# EAGLE schematic main (EAGLE 8.0.0), part 4 of 4
## Sheet 41 of 48: rega mux
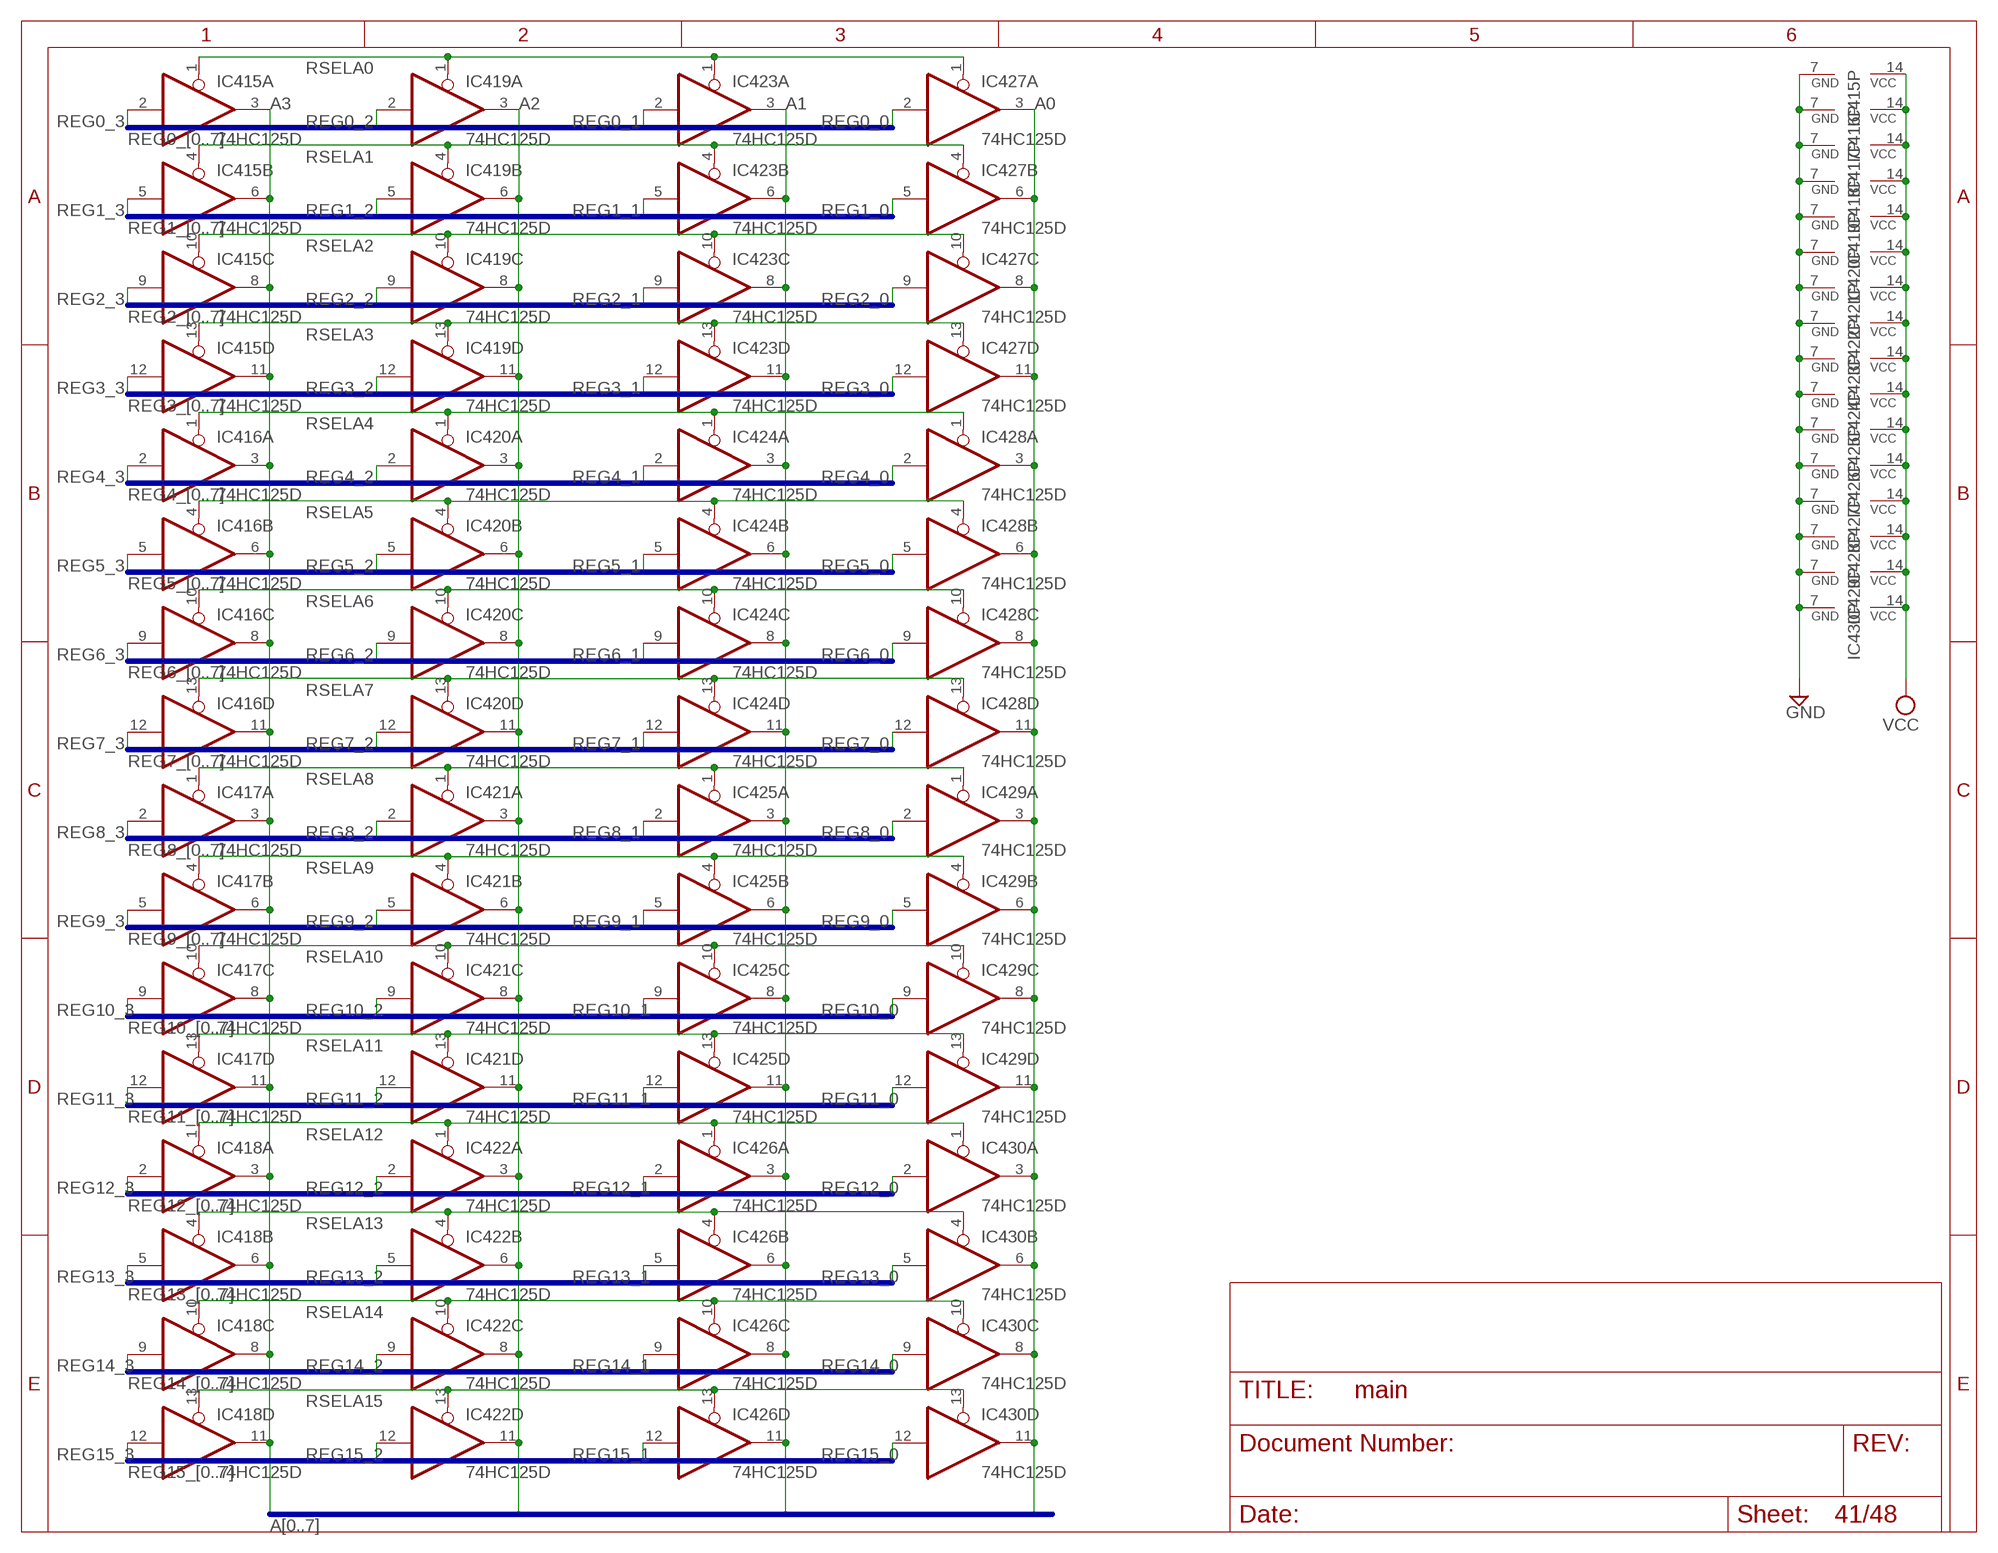
[diagram p39: schematic, sheet 41]

### Parts
IC415  74HC125D  [SO14]
IC416  74HC125D  [SO14]
IC417  74HC125D  [SO14]
IC418  74HC125D  [SO14]
IC419  74HC125D  [SO14]
IC420  74HC125D  [SO14]
IC421  74HC125D  [SO14]
IC422  74HC125D  [SO14]
IC423  74HC125D  [SO14]
IC424  74HC125D  [SO14]
IC425  74HC125D  [SO14]
IC426  74HC125D  [SO14]
IC427  74HC125D  [SO14]
IC428  74HC125D  [SO14]
IC429  74HC125D  [SO14]
IC430  74HC125D  [SO14]

### Nets
A0: IC427.3(A:O) IC427.6(B:O) IC427.8(C:O) IC427.11(D:O) IC428.3(A:O) IC428.6(B:O) IC428.8(C:O) IC428.11(D:O) IC429.3(A:O) IC429.6(B:O) IC429.8(C:O) IC429.11(D:O) IC430.3(A:O) IC430.6(B:O) IC430.8(C:O) IC430.11(D:O) ; also sheet 1,3,4,11,24,25,26,30,34
A1: IC423.3(A:O) IC423.6(B:O) IC423.8(C:O) IC423.11(D:O) IC424.3(A:O) IC424.6(B:O) IC424.8(C:O) IC424.11(D:O) IC425.3(A:O) IC425.6(B:O) IC425.8(C:O) IC425.11(D:O) IC426.3(A:O) IC426.6(B:O) IC426.8(C:O) IC426.11(D:O) ; also sheet 1,3,4,11,19,24,25,26,30,34
A2: IC419.3(A:O) IC419.6(B:O) IC419.8(C:O) IC419.11(D:O) IC420.3(A:O) IC420.6(B:O) IC420.8(C:O) IC420.11(D:O) IC421.3(A:O) IC421.6(B:O) IC421.8(C:O) IC421.11(D:O) IC422.3(A:O) IC422.6(B:O) IC422.8(C:O) IC422.11(D:O) ; also sheet 1,24,25,26,30,34
A3: IC415.3(A:O) IC415.6(B:O) IC415.8(C:O) IC415.11(D:O) IC416.3(A:O) IC416.6(B:O) IC416.8(C:O) IC416.11(D:O) IC417.3(A:O) IC417.6(B:O) IC417.8(C:O) IC417.11(D:O) IC418.3(A:O) IC418.6(B:O) IC418.8(C:O) IC418.11(D:O) ; also sheet 1,2,5,6,11,22,24,25,26,30,34
GND: IC415.7(P:GND) IC416.7(P:GND) IC417.7(P:GND) IC418.7(P:GND) IC419.7(P:GND) IC420.7(P:GND) IC421.7(P:GND) IC422.7(P:GND) IC423.7(P:GND) IC424.7(P:GND) IC425.7(P:GND) IC426.7(P:GND) IC427.7(P:GND) IC428.7(P:GND) IC429.7(P:GND) IC430.7(P:GND) ; also sheet 1,2,3,4,5,6,7,8,9,10,11,12,13,14,15,16,17,18,19,20,21,22,23,24,25,26,27,28,29,30,31,32,33,34,37,38,39,40,42,43,44,45,46,47
REG0_0: IC427.2(A:I) ; also sheet 43
REG0_1: IC423.2(A:I) ; also sheet 43
REG0_2: IC419.2(A:I) ; also sheet 43
REG0_3: IC415.2(A:I) ; also sheet 43
REG1_0: IC427.5(B:I) ; also sheet 43
REG1_1: IC423.5(B:I) ; also sheet 43
REG1_2: IC419.5(B:I) ; also sheet 43
REG1_3: IC415.5(B:I) ; also sheet 43
REG2_0: IC427.9(C:I) ; also sheet 43
REG2_1: IC423.9(C:I) ; also sheet 43
REG2_2: IC419.9(C:I) ; also sheet 43
REG2_3: IC415.9(C:I) ; also sheet 43
REG3_0: IC427.12(D:I) ; also sheet 43
REG3_1: IC423.12(D:I) ; also sheet 43
REG3_2: IC419.12(D:I) ; also sheet 43
REG3_3: IC415.12(D:I) ; also sheet 43
REG4_0: IC428.2(A:I) ; also sheet 43
REG4_1: IC424.2(A:I) ; also sheet 43
REG4_2: IC420.2(A:I) ; also sheet 43
REG4_3: IC416.2(A:I) ; also sheet 43
REG5_0: IC428.5(B:I) ; also sheet 43
REG5_1: IC424.5(B:I) ; also sheet 43
REG5_2: IC420.5(B:I) ; also sheet 43
REG5_3: IC416.5(B:I) ; also sheet 43
REG6_0: IC428.9(C:I) ; also sheet 43
REG6_1: IC424.9(C:I) ; also sheet 43
REG6_2: IC420.9(C:I) ; also sheet 43
REG6_3: IC416.9(C:I) ; also sheet 43
REG7_0: IC428.12(D:I) ; also sheet 43
REG7_1: IC424.12(D:I) ; also sheet 43
REG7_2: IC420.12(D:I) ; also sheet 43
REG7_3: IC416.12(D:I) ; also sheet 43
REG8_0: IC429.2(A:I) ; also sheet 43
REG8_1: IC425.2(A:I) ; also sheet 43
REG8_2: IC421.2(A:I) ; also sheet 43
REG8_3: IC417.2(A:I) ; also sheet 43
REG9_0: IC429.5(B:I) ; also sheet 43
REG9_1: IC425.5(B:I) ; also sheet 43
REG9_2: IC421.5(B:I) ; also sheet 43
REG9_3: IC417.5(B:I) ; also sheet 43
REG10_0: IC429.9(C:I) ; also sheet 43
REG10_1: IC425.9(C:I) ; also sheet 43
REG10_2: IC421.9(C:I) ; also sheet 43
REG10_3: IC417.9(C:I) ; also sheet 43
REG11_0: IC429.12(D:I) ; also sheet 43
REG11_1: IC425.12(D:I) ; also sheet 43
REG11_2: IC421.12(D:I) ; also sheet 43
REG11_3: IC417.12(D:I) ; also sheet 43
REG12_0: IC430.2(A:I) ; also sheet 43
REG12_1: IC426.2(A:I) ; also sheet 43
REG12_2: IC422.2(A:I) ; also sheet 43
REG12_3: IC418.2(A:I) ; also sheet 43
REG13_0: IC430.5(B:I) ; also sheet 43
REG13_1: IC426.5(B:I) ; also sheet 43
REG13_2: IC422.5(B:I) ; also sheet 43
REG13_3: IC418.5(B:I) ; also sheet 43
REG14_0: IC430.9(C:I) ; also sheet 43,47
REG14_1: IC426.9(C:I) ; also sheet 43,47
REG14_2: IC422.9(C:I) ; also sheet 43,47
REG14_3: IC418.9(C:I) ; also sheet 43,47
REG15_0: IC430.12(D:I) ; also sheet 43,48
REG15_1: IC426.12(D:I) ; also sheet 43
REG15_2: IC422.12(D:I) ; also sheet 43
REG15_3: IC418.12(D:I) ; also sheet 43
RSELA0: IC415.1(A:OE) IC419.1(A:OE) IC423.1(A:OE) IC427.1(A:OE) ; also sheet 38,40
RSELA1: IC415.4(B:OE) IC419.4(B:OE) IC423.4(B:OE) IC427.4(B:OE) ; also sheet 38,40
RSELA2: IC415.10(C:OE) IC419.10(C:OE) IC423.10(C:OE) IC427.10(C:OE) ; also sheet 38,40
RSELA3: IC415.13(D:OE) IC419.13(D:OE) IC423.13(D:OE) IC427.13(D:OE) ; also sheet 38,40
RSELA4: IC416.1(A:OE) IC420.1(A:OE) IC424.1(A:OE) IC428.1(A:OE) ; also sheet 38,40,42
RSELA5: IC416.4(B:OE) IC420.4(B:OE) IC424.4(B:OE) IC428.4(B:OE) ; also sheet 38,40
RSELA6: IC416.10(C:OE) IC420.10(C:OE) IC424.10(C:OE) IC428.10(C:OE) ; also sheet 38,40
RSELA7: IC416.13(D:OE) IC420.13(D:OE) IC424.13(D:OE) IC428.13(D:OE) ; also sheet 38,40
RSELA8: IC417.1(A:OE) IC421.1(A:OE) IC425.1(A:OE) IC429.1(A:OE) ; also sheet 38,40
RSELA9: IC417.4(B:OE) IC421.4(B:OE) IC425.4(B:OE) IC429.4(B:OE) ; also sheet 38,40
RSELA10: IC417.10(C:OE) IC421.10(C:OE) IC425.10(C:OE) IC429.10(C:OE) ; also sheet 38,40
RSELA11: IC417.13(D:OE) IC421.13(D:OE) IC425.13(D:OE) IC429.13(D:OE) ; also sheet 38,40
RSELA12: IC418.1(A:OE) IC422.1(A:OE) IC426.1(A:OE) IC430.1(A:OE) ; also sheet 38,40
RSELA13: IC418.4(B:OE) IC422.4(B:OE) IC426.4(B:OE) IC430.4(B:OE) ; also sheet 38,40
RSELA14: IC418.10(C:OE) IC422.10(C:OE) IC426.10(C:OE) IC430.10(C:OE) ; also sheet 38,40
RSELA15: IC418.13(D:OE) IC422.13(D:OE) IC426.13(D:OE) IC430.13(D:OE) ; also sheet 38,40
VCC: IC415.14(P:VCC) IC416.14(P:VCC) IC417.14(P:VCC) IC418.14(P:VCC) IC419.14(P:VCC) IC420.14(P:VCC) IC421.14(P:VCC) IC422.14(P:VCC) IC423.14(P:VCC) IC424.14(P:VCC) IC425.14(P:VCC) IC426.14(P:VCC) IC427.14(P:VCC) IC428.14(P:VCC) IC429.14(P:VCC) IC430.14(P:VCC) ; also sheet 1,2,3,4,5,6,7,8,9,10,11,12,13,14,15,16,17,18,19,20,21,22,23,24,25,26,27,28,29,30,31,32,33,34,37,38,39,40,42,43,44,45,46,47

### Buses
A[0..7]
REG0_[0..7]
REG1_[0..7]
REG3_[0..7]
REG4_[0..7]
REG5_[0..7]
REG6_[0..7]
REG7_[0..7]
REG8_[0..7]
REG9_[0..7]
REG10_[0..7]
REG11_[0..7]
REG12_[0..7]
REG13_[0..7]
REG14_[0..7]
REG15_[0..7]
REG2_[0..7]

## Sheet 42 of 48: rselb mux
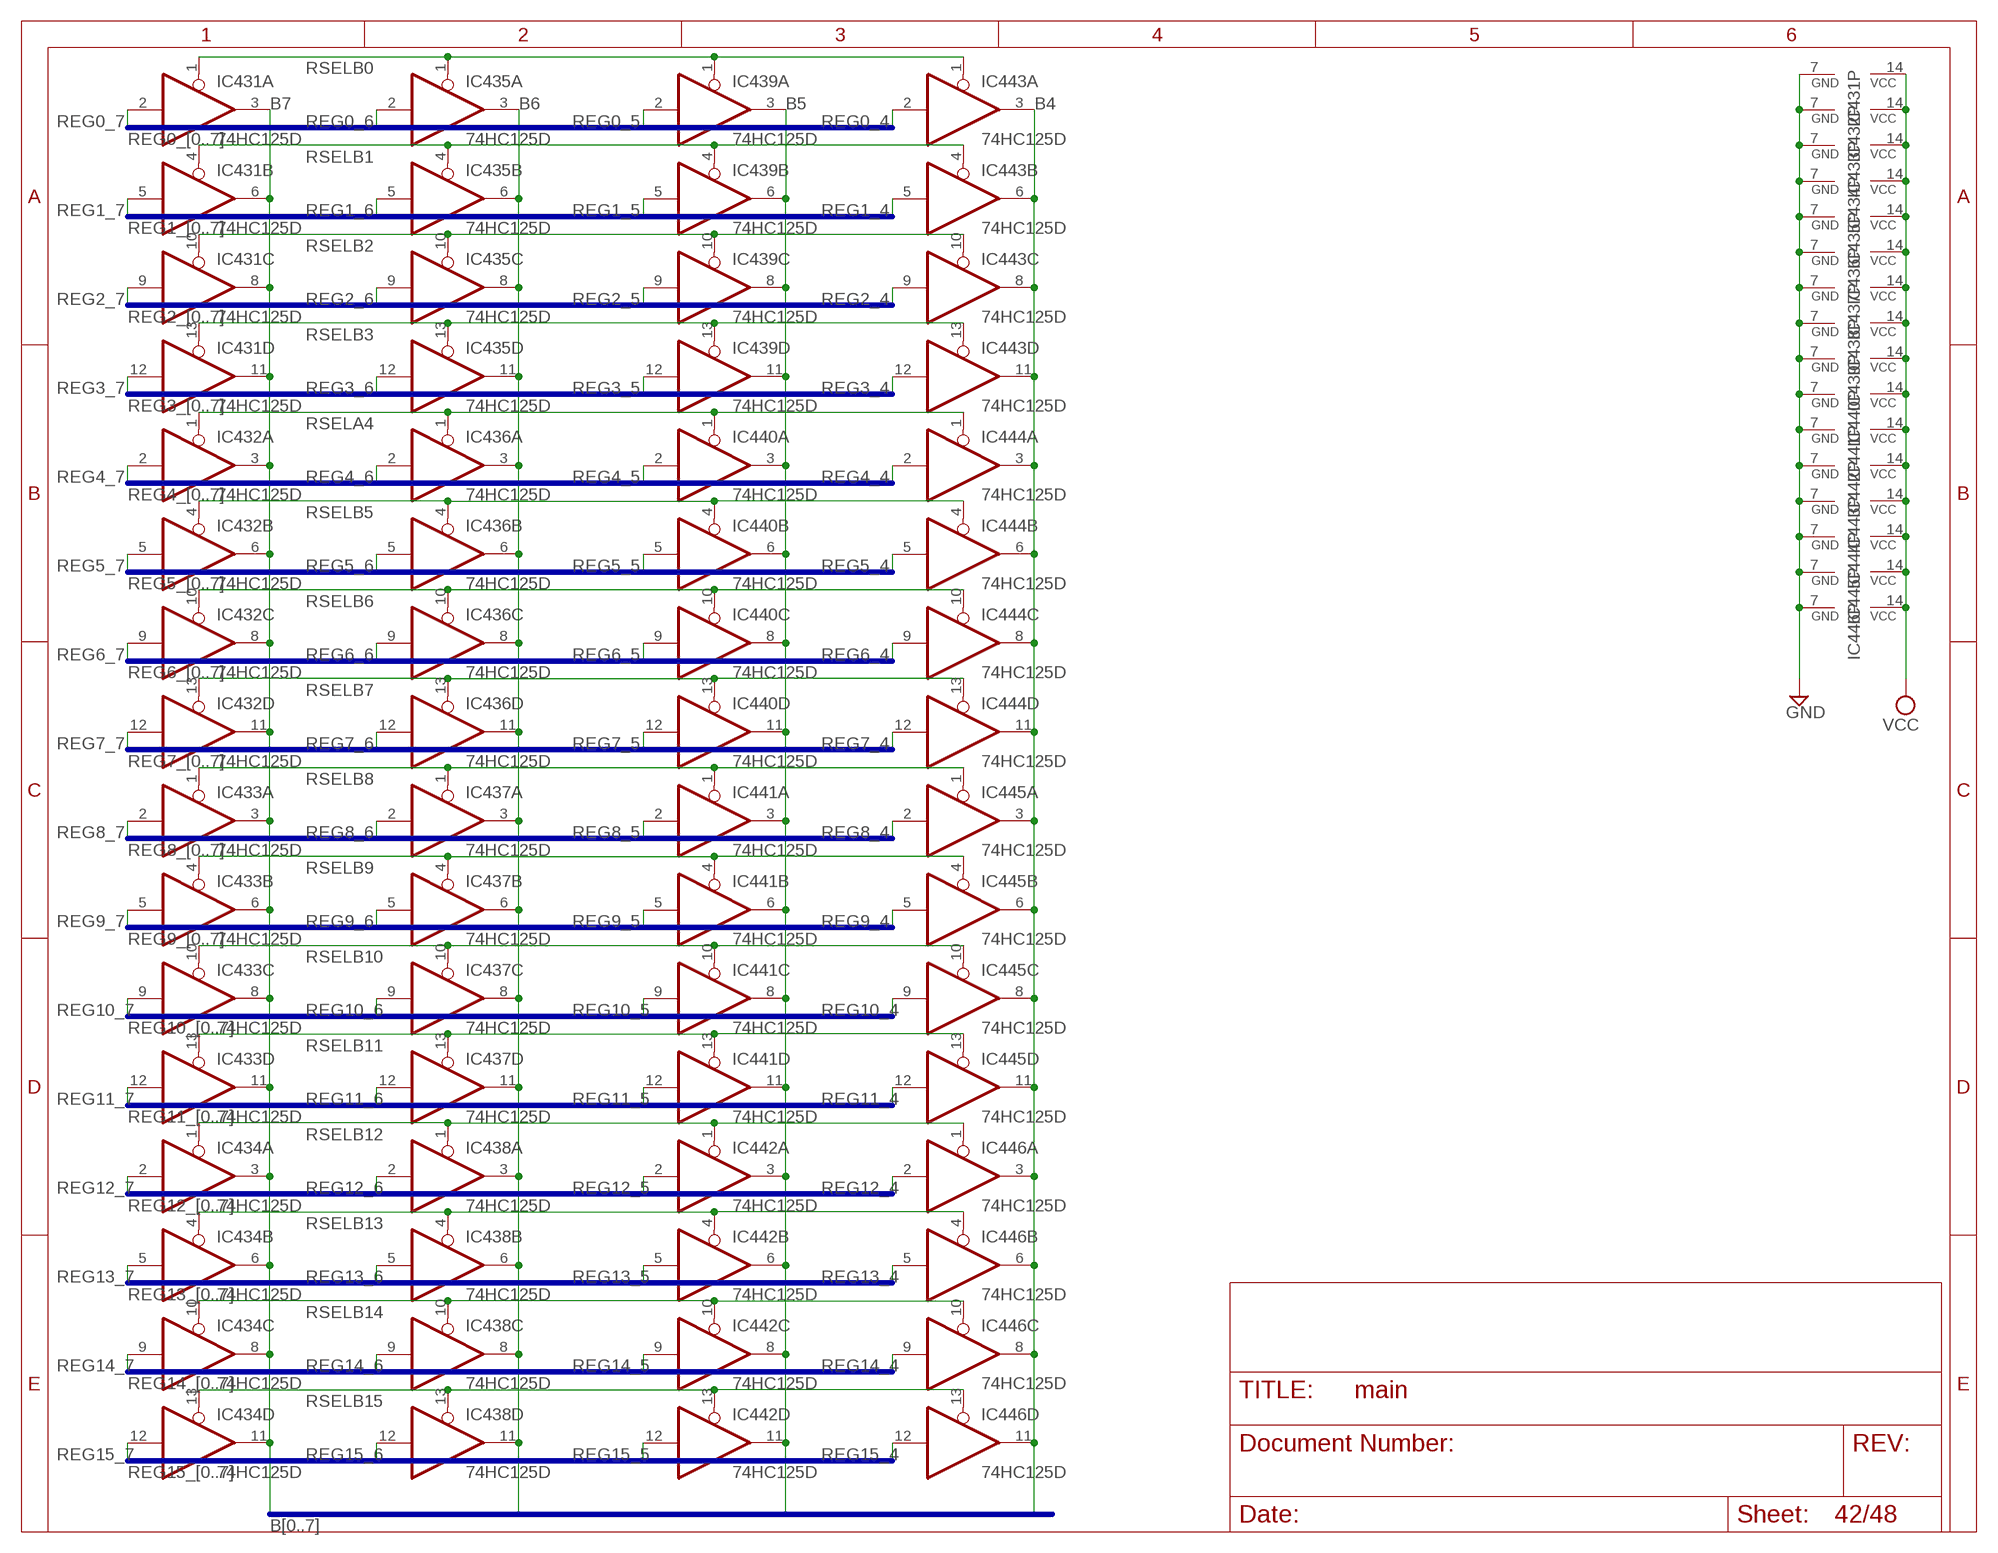
[diagram p40: schematic, sheet 42]

### Parts
IC431  74HC125D  [SO14]
IC432  74HC125D  [SO14]
IC433  74HC125D  [SO14]
IC434  74HC125D  [SO14]
IC435  74HC125D  [SO14]
IC436  74HC125D  [SO14]
IC437  74HC125D  [SO14]
IC438  74HC125D  [SO14]
IC439  74HC125D  [SO14]
IC440  74HC125D  [SO14]
IC441  74HC125D  [SO14]
IC442  74HC125D  [SO14]
IC443  74HC125D  [SO14]
IC444  74HC125D  [SO14]
IC445  74HC125D  [SO14]
IC446  74HC125D  [SO14]

### Nets
B4: IC443.3(A:O) IC443.6(B:O) IC443.8(C:O) IC443.11(D:O) IC444.3(A:O) IC444.6(B:O) IC444.8(C:O) IC444.11(D:O) IC445.3(A:O) IC445.6(B:O) IC445.8(C:O) IC445.11(D:O) IC446.3(A:O) IC446.6(B:O) IC446.8(C:O) IC446.11(D:O) ; also sheet 3,4,5,6,7,8,9,10,24,25,27,34
B5: IC439.3(A:O) IC439.6(B:O) IC439.8(C:O) IC439.11(D:O) IC440.3(A:O) IC440.6(B:O) IC440.8(C:O) IC440.11(D:O) IC441.3(A:O) IC441.6(B:O) IC441.8(C:O) IC441.11(D:O) IC442.3(A:O) IC442.6(B:O) IC442.8(C:O) IC442.11(D:O) ; also sheet 3,5,7,9,24,25,27,34
B6: IC435.3(A:O) IC435.6(B:O) IC435.8(C:O) IC435.11(D:O) IC436.3(A:O) IC436.6(B:O) IC436.8(C:O) IC436.11(D:O) IC437.3(A:O) IC437.6(B:O) IC437.8(C:O) IC437.11(D:O) IC438.3(A:O) IC438.6(B:O) IC438.8(C:O) IC438.11(D:O) ; also sheet 3,5,7,9,24,25,27,34
B7: IC431.3(A:O) IC431.6(B:O) IC431.8(C:O) IC431.11(D:O) IC432.3(A:O) IC432.6(B:O) IC432.8(C:O) IC432.11(D:O) IC433.3(A:O) IC433.6(B:O) IC433.8(C:O) IC433.11(D:O) IC434.3(A:O) IC434.6(B:O) IC434.8(C:O) IC434.11(D:O) ; also sheet 3,5,7,9,24,25,27,34
GND: IC431.7(P:GND) IC432.7(P:GND) IC433.7(P:GND) IC434.7(P:GND) IC435.7(P:GND) IC436.7(P:GND) IC437.7(P:GND) IC438.7(P:GND) IC439.7(P:GND) IC440.7(P:GND) IC441.7(P:GND) IC442.7(P:GND) IC443.7(P:GND) IC444.7(P:GND) IC445.7(P:GND) IC446.7(P:GND) ; also sheet 1,2,3,4,5,6,7,8,9,10,11,12,13,14,15,16,17,18,19,20,21,22,23,24,25,26,27,28,29,30,31,32,33,34,37,38,39,40,41,43,44,45,46,47
REG0_4: IC443.2(A:I) ; also sheet 40
REG0_5: IC439.2(A:I) ; also sheet 40
REG0_6: IC435.2(A:I) ; also sheet 40
REG0_7: IC431.2(A:I) ; also sheet 40
REG1_4: IC443.5(B:I) ; also sheet 40
REG1_5: IC439.5(B:I) ; also sheet 40
REG1_6: IC435.5(B:I) ; also sheet 40
REG1_7: IC431.5(B:I) ; also sheet 40
REG2_4: IC443.9(C:I) ; also sheet 40
REG2_5: IC439.9(C:I) ; also sheet 40
REG2_6: IC435.9(C:I) ; also sheet 40
REG2_7: IC431.9(C:I) ; also sheet 40
REG3_4: IC443.12(D:I) ; also sheet 40
REG3_5: IC439.12(D:I) ; also sheet 40
REG3_6: IC435.12(D:I) ; also sheet 40
REG3_7: IC431.12(D:I) ; also sheet 40
REG4_4: IC444.2(A:I) ; also sheet 40
REG4_5: IC440.2(A:I) ; also sheet 40
REG4_6: IC436.2(A:I) ; also sheet 40
REG4_7: IC432.2(A:I) ; also sheet 40
REG5_4: IC444.5(B:I) ; also sheet 40
REG5_5: IC440.5(B:I) ; also sheet 40
REG5_6: IC436.5(B:I) ; also sheet 40
REG5_7: IC432.5(B:I) ; also sheet 40
REG6_4: IC444.9(C:I) ; also sheet 40
REG6_5: IC440.9(C:I) ; also sheet 40
REG6_6: IC436.9(C:I) ; also sheet 40
REG6_7: IC432.9(C:I) ; also sheet 40
REG7_4: IC444.12(D:I) ; also sheet 40
REG7_5: IC440.12(D:I) ; also sheet 40
REG7_6: IC436.12(D:I) ; also sheet 40
REG7_7: IC432.12(D:I) ; also sheet 40
REG8_4: IC445.2(A:I) ; also sheet 40
REG8_5: IC441.2(A:I) ; also sheet 40
REG8_6: IC437.2(A:I) ; also sheet 40
REG8_7: IC433.2(A:I) ; also sheet 40
REG9_4: IC445.5(B:I) ; also sheet 40
REG9_5: IC441.5(B:I) ; also sheet 40
REG9_6: IC437.5(B:I) ; also sheet 40
REG9_7: IC433.5(B:I) ; also sheet 40
REG10_4: IC445.9(C:I) ; also sheet 40
REG10_5: IC441.9(C:I) ; also sheet 40
REG10_6: IC437.9(C:I) ; also sheet 40
REG10_7: IC433.9(C:I) ; also sheet 40
REG11_4: IC445.12(D:I) ; also sheet 40
REG11_5: IC441.12(D:I) ; also sheet 40
REG11_6: IC437.12(D:I) ; also sheet 40
REG11_7: IC433.12(D:I) ; also sheet 40
REG12_4: IC446.2(A:I) ; also sheet 40
REG12_5: IC442.2(A:I) ; also sheet 40
REG12_6: IC438.2(A:I) ; also sheet 40
REG12_7: IC434.2(A:I) ; also sheet 40
REG13_4: IC446.5(B:I) ; also sheet 40
REG13_5: IC442.5(B:I) ; also sheet 40
REG13_6: IC438.5(B:I) ; also sheet 40
REG13_7: IC434.5(B:I) ; also sheet 40
REG14_4: IC446.9(C:I) ; also sheet 40,47
REG14_5: IC442.9(C:I) ; also sheet 40,47
REG14_6: IC438.9(C:I) ; also sheet 40,47
REG14_7: IC434.9(C:I) ; also sheet 40,47
REG15_4: IC446.12(D:I) ; also sheet 40
REG15_5: IC442.12(D:I) ; also sheet 40,48
REG15_6: IC438.12(D:I) ; also sheet 40,48
REG15_7: IC434.12(D:I) ; also sheet 40,48
RSELA4: IC432.1(A:OE) IC436.1(A:OE) IC440.1(A:OE) IC444.1(A:OE) ; also sheet 38,40,41
RSELB0: IC431.1(A:OE) IC435.1(A:OE) IC439.1(A:OE) IC443.1(A:OE) ; also sheet 39,43
RSELB1: IC431.4(B:OE) IC435.4(B:OE) IC439.4(B:OE) IC443.4(B:OE) ; also sheet 39,43
RSELB2: IC431.10(C:OE) IC435.10(C:OE) IC439.10(C:OE) IC443.10(C:OE) ; also sheet 39,43
RSELB3: IC431.13(D:OE) IC435.13(D:OE) IC439.13(D:OE) IC443.13(D:OE) ; also sheet 39,43
RSELB5: IC432.4(B:OE) IC436.4(B:OE) IC440.4(B:OE) IC444.4(B:OE) ; also sheet 39,43
RSELB6: IC432.10(C:OE) IC436.10(C:OE) IC440.10(C:OE) IC444.10(C:OE) ; also sheet 39,43
RSELB7: IC432.13(D:OE) IC436.13(D:OE) IC440.13(D:OE) IC444.13(D:OE) ; also sheet 39,43
RSELB8: IC433.1(A:OE) IC437.1(A:OE) IC441.1(A:OE) IC445.1(A:OE) ; also sheet 39,43
RSELB9: IC433.4(B:OE) IC437.4(B:OE) IC441.4(B:OE) IC445.4(B:OE) ; also sheet 39,43
RSELB10: IC433.10(C:OE) IC437.10(C:OE) IC441.10(C:OE) IC445.10(C:OE) ; also sheet 39,43
RSELB11: IC433.13(D:OE) IC437.13(D:OE) IC441.13(D:OE) IC445.13(D:OE) ; also sheet 39,43
RSELB12: IC434.1(A:OE) IC438.1(A:OE) IC442.1(A:OE) IC446.1(A:OE) ; also sheet 39,43
RSELB13: IC434.4(B:OE) IC438.4(B:OE) IC442.4(B:OE) IC446.4(B:OE) ; also sheet 39,43
RSELB14: IC434.10(C:OE) IC438.10(C:OE) IC442.10(C:OE) IC446.10(C:OE) ; also sheet 39,43
RSELB15: IC434.13(D:OE) IC438.13(D:OE) IC442.13(D:OE) IC446.13(D:OE) ; also sheet 39,43
VCC: IC431.14(P:VCC) IC432.14(P:VCC) IC433.14(P:VCC) IC434.14(P:VCC) IC435.14(P:VCC) IC436.14(P:VCC) IC437.14(P:VCC) IC438.14(P:VCC) IC439.14(P:VCC) IC440.14(P:VCC) IC441.14(P:VCC) IC442.14(P:VCC) IC443.14(P:VCC) IC444.14(P:VCC) IC445.14(P:VCC) IC446.14(P:VCC) ; also sheet 1,2,3,4,5,6,7,8,9,10,11,12,13,14,15,16,17,18,19,20,21,22,23,24,25,26,27,28,29,30,31,32,33,34,37,38,39,40,41,43,44,45,46,47

### Buses
B[0..7]
REG0_[0..7]
REG1_[0..7]
REG3_[0..7]
REG4_[0..7]
REG5_[0..7]
REG6_[0..7]
REG7_[0..7]
REG8_[0..7]
REG9_[0..7]
REG10_[0..7]
REG11_[0..7]
REG12_[0..7]
REG13_[0..7]
REG14_[0..7]
REG15_[0..7]
REG2_[0..7]

## Sheet 43 of 48: rselb mux
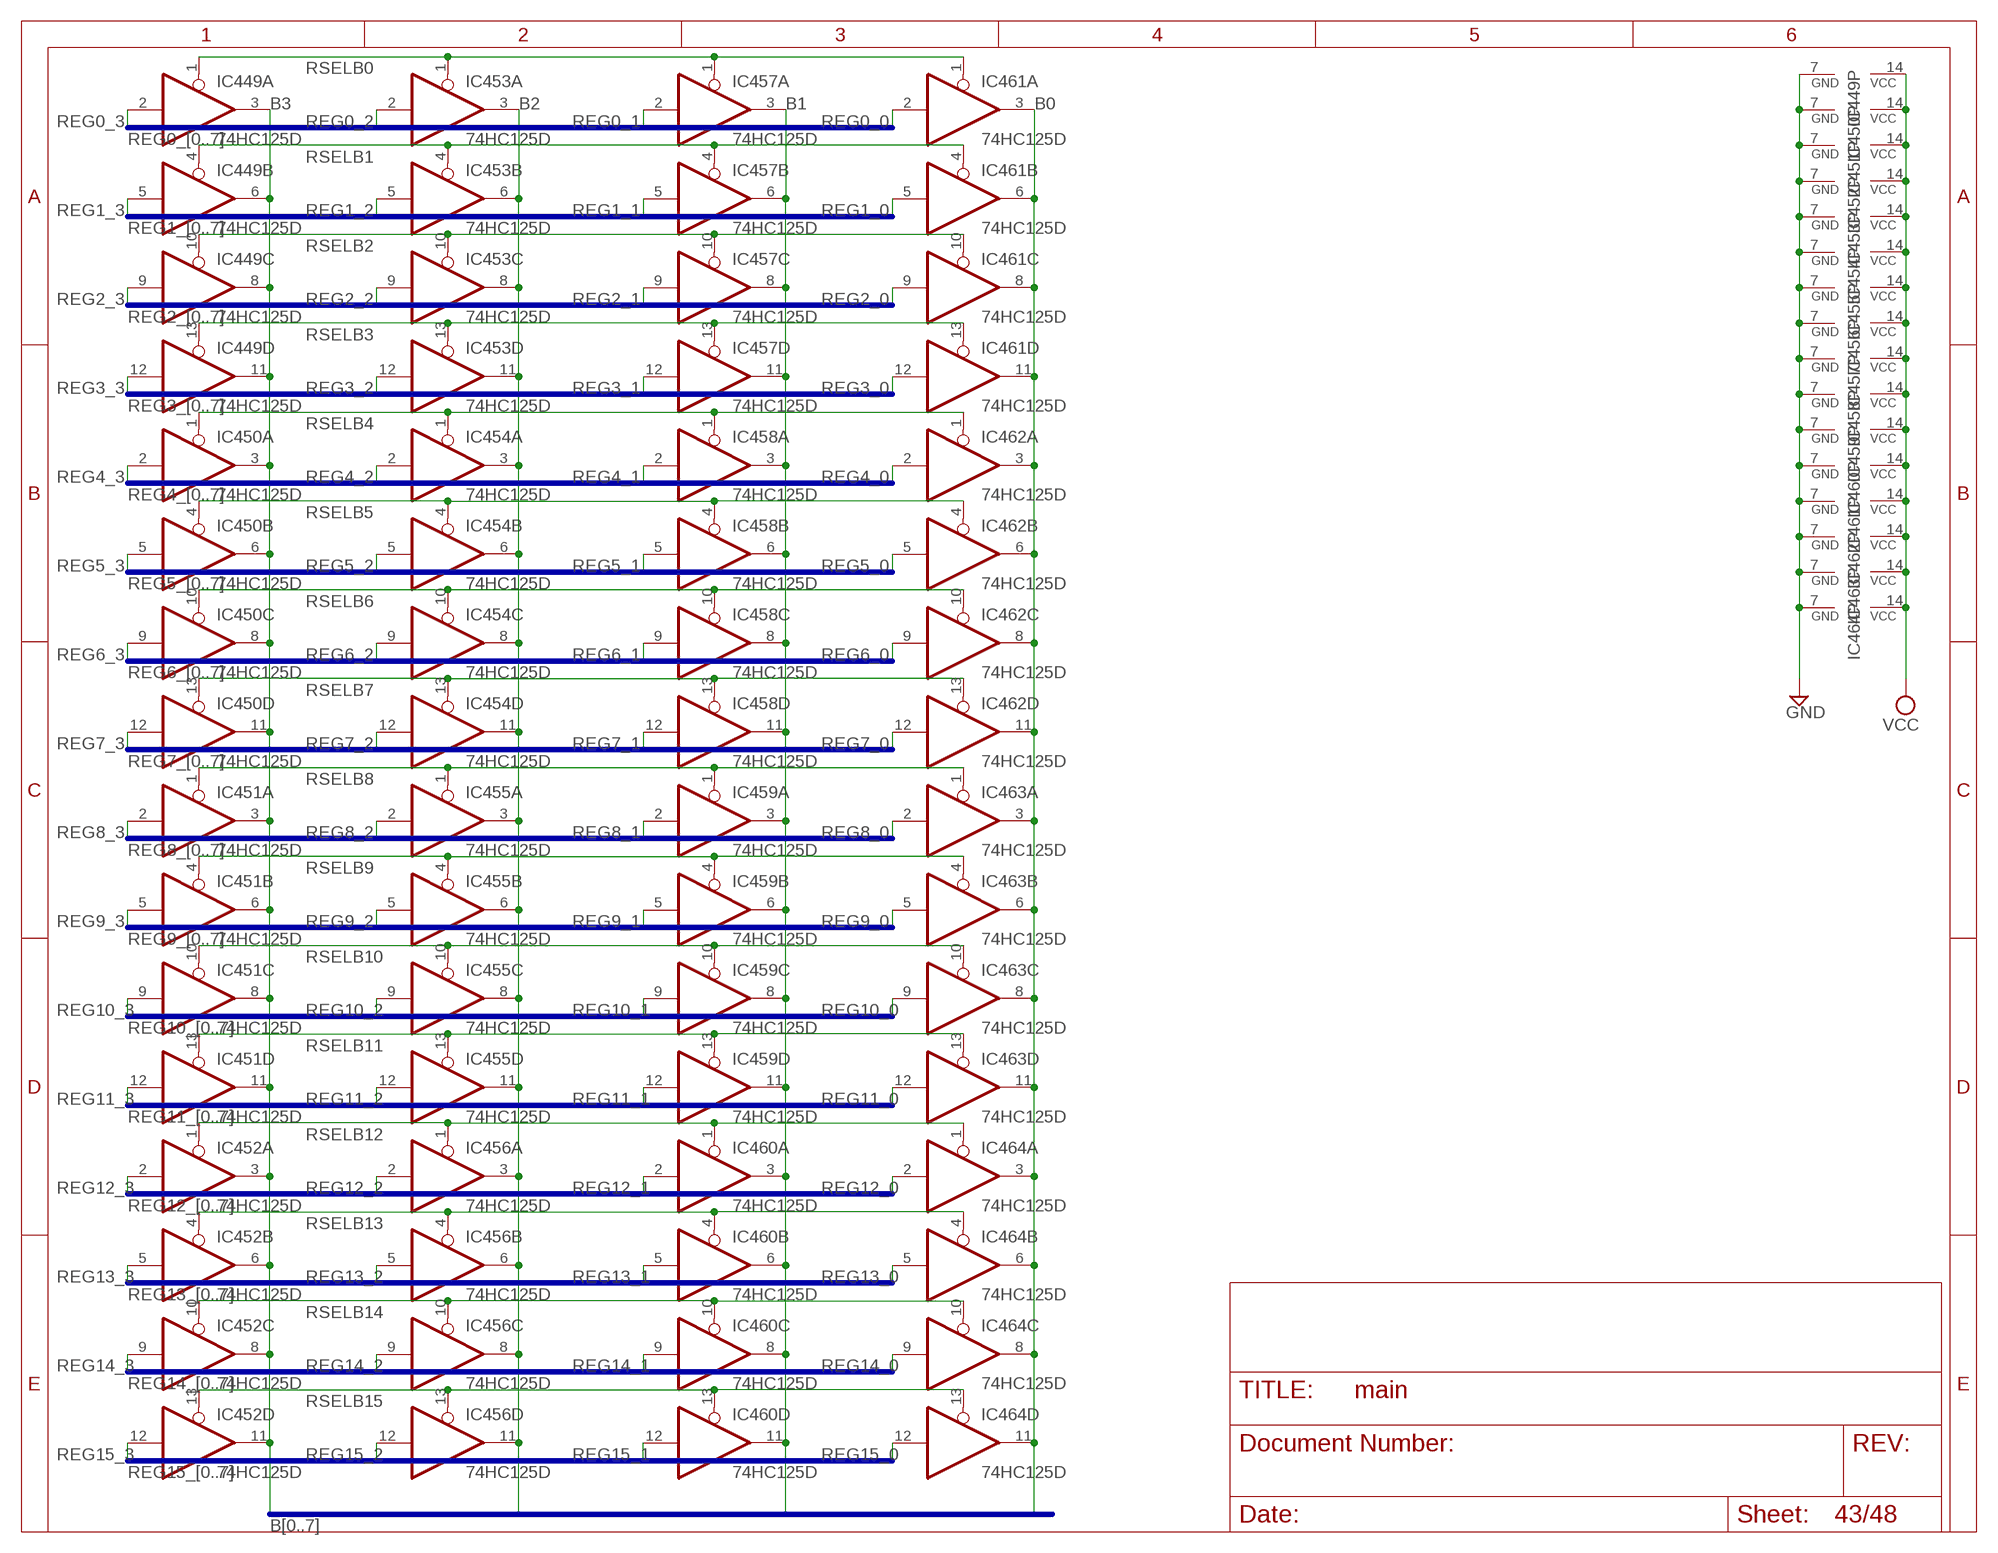
[diagram p41: schematic, sheet 43]

### Parts
IC449  74HC125D  [SO14]
IC450  74HC125D  [SO14]
IC451  74HC125D  [SO14]
IC452  74HC125D  [SO14]
IC453  74HC125D  [SO14]
IC454  74HC125D  [SO14]
IC455  74HC125D  [SO14]
IC456  74HC125D  [SO14]
IC457  74HC125D  [SO14]
IC458  74HC125D  [SO14]
IC459  74HC125D  [SO14]
IC460  74HC125D  [SO14]
IC461  74HC125D  [SO14]
IC462  74HC125D  [SO14]
IC463  74HC125D  [SO14]
IC464  74HC125D  [SO14]

### Nets
B0: IC461.3(A:O) IC461.6(B:O) IC461.8(C:O) IC461.11(D:O) IC462.3(A:O) IC462.6(B:O) IC462.8(C:O) IC462.11(D:O) IC463.3(A:O) IC463.6(B:O) IC463.8(C:O) IC463.11(D:O) IC464.3(A:O) IC464.6(B:O) IC464.8(C:O) IC464.11(D:O) ; also sheet 4,6,8,10,11,24,25,26,34
B1: IC457.3(A:O) IC457.6(B:O) IC457.8(C:O) IC457.11(D:O) IC458.3(A:O) IC458.6(B:O) IC458.8(C:O) IC458.11(D:O) IC459.3(A:O) IC459.6(B:O) IC459.8(C:O) IC459.11(D:O) IC460.3(A:O) IC460.6(B:O) IC460.8(C:O) IC460.11(D:O) ; also sheet 4,6,8,10,24,25,26,34
B2: IC453.3(A:O) IC453.6(B:O) IC453.8(C:O) IC453.11(D:O) IC454.3(A:O) IC454.6(B:O) IC454.8(C:O) IC454.11(D:O) IC455.3(A:O) IC455.6(B:O) IC455.8(C:O) IC455.11(D:O) IC456.3(A:O) IC456.6(B:O) IC456.8(C:O) IC456.11(D:O) ; also sheet 4,6,8,10,24,25,26,34
B3: IC449.3(A:O) IC449.6(B:O) IC449.8(C:O) IC449.11(D:O) IC450.3(A:O) IC450.6(B:O) IC450.8(C:O) IC450.11(D:O) IC451.3(A:O) IC451.6(B:O) IC451.8(C:O) IC451.11(D:O) IC452.3(A:O) IC452.6(B:O) IC452.8(C:O) IC452.11(D:O) ; also sheet 4,6,8,10,24,25,26,34
GND: IC449.7(P:GND) IC450.7(P:GND) IC451.7(P:GND) IC452.7(P:GND) IC453.7(P:GND) IC454.7(P:GND) IC455.7(P:GND) IC456.7(P:GND) IC457.7(P:GND) IC458.7(P:GND) IC459.7(P:GND) IC460.7(P:GND) IC461.7(P:GND) IC462.7(P:GND) IC463.7(P:GND) IC464.7(P:GND) ; also sheet 1,2,3,4,5,6,7,8,9,10,11,12,13,14,15,16,17,18,19,20,21,22,23,24,25,26,27,28,29,30,31,32,33,34,37,38,39,40,41,42,44,45,46,47
REG0_0: IC461.2(A:I) ; also sheet 41
REG0_1: IC457.2(A:I) ; also sheet 41
REG0_2: IC453.2(A:I) ; also sheet 41
REG0_3: IC449.2(A:I) ; also sheet 41
REG1_0: IC461.5(B:I) ; also sheet 41
REG1_1: IC457.5(B:I) ; also sheet 41
REG1_2: IC453.5(B:I) ; also sheet 41
REG1_3: IC449.5(B:I) ; also sheet 41
REG2_0: IC461.9(C:I) ; also sheet 41
REG2_1: IC457.9(C:I) ; also sheet 41
REG2_2: IC453.9(C:I) ; also sheet 41
REG2_3: IC449.9(C:I) ; also sheet 41
REG3_0: IC461.12(D:I) ; also sheet 41
REG3_1: IC457.12(D:I) ; also sheet 41
REG3_2: IC453.12(D:I) ; also sheet 41
REG3_3: IC449.12(D:I) ; also sheet 41
REG4_0: IC462.2(A:I) ; also sheet 41
REG4_1: IC458.2(A:I) ; also sheet 41
REG4_2: IC454.2(A:I) ; also sheet 41
REG4_3: IC450.2(A:I) ; also sheet 41
REG5_0: IC462.5(B:I) ; also sheet 41
REG5_1: IC458.5(B:I) ; also sheet 41
REG5_2: IC454.5(B:I) ; also sheet 41
REG5_3: IC450.5(B:I) ; also sheet 41
REG6_0: IC462.9(C:I) ; also sheet 41
REG6_1: IC458.9(C:I) ; also sheet 41
REG6_2: IC454.9(C:I) ; also sheet 41
REG6_3: IC450.9(C:I) ; also sheet 41
REG7_0: IC462.12(D:I) ; also sheet 41
REG7_1: IC458.12(D:I) ; also sheet 41
REG7_2: IC454.12(D:I) ; also sheet 41
REG7_3: IC450.12(D:I) ; also sheet 41
REG8_0: IC463.2(A:I) ; also sheet 41
REG8_1: IC459.2(A:I) ; also sheet 41
REG8_2: IC455.2(A:I) ; also sheet 41
REG8_3: IC451.2(A:I) ; also sheet 41
REG9_0: IC463.5(B:I) ; also sheet 41
REG9_1: IC459.5(B:I) ; also sheet 41
REG9_2: IC455.5(B:I) ; also sheet 41
REG9_3: IC451.5(B:I) ; also sheet 41
REG10_0: IC463.9(C:I) ; also sheet 41
REG10_1: IC459.9(C:I) ; also sheet 41
REG10_2: IC455.9(C:I) ; also sheet 41
REG10_3: IC451.9(C:I) ; also sheet 41
REG11_0: IC463.12(D:I) ; also sheet 41
REG11_1: IC459.12(D:I) ; also sheet 41
REG11_2: IC455.12(D:I) ; also sheet 41
REG11_3: IC451.12(D:I) ; also sheet 41
REG12_0: IC464.2(A:I) ; also sheet 41
REG12_1: IC460.2(A:I) ; also sheet 41
REG12_2: IC456.2(A:I) ; also sheet 41
REG12_3: IC452.2(A:I) ; also sheet 41
REG13_0: IC464.5(B:I) ; also sheet 41
REG13_1: IC460.5(B:I) ; also sheet 41
REG13_2: IC456.5(B:I) ; also sheet 41
REG13_3: IC452.5(B:I) ; also sheet 41
REG14_0: IC464.9(C:I) ; also sheet 41,47
REG14_1: IC460.9(C:I) ; also sheet 41,47
REG14_2: IC456.9(C:I) ; also sheet 41,47
REG14_3: IC452.9(C:I) ; also sheet 41,47
REG15_0: IC464.12(D:I) ; also sheet 41,48
REG15_1: IC460.12(D:I) ; also sheet 41
REG15_2: IC456.12(D:I) ; also sheet 41
REG15_3: IC452.12(D:I) ; also sheet 41
RSELB0: IC449.1(A:OE) IC453.1(A:OE) IC457.1(A:OE) IC461.1(A:OE) ; also sheet 39,42
RSELB1: IC449.4(B:OE) IC453.4(B:OE) IC457.4(B:OE) IC461.4(B:OE) ; also sheet 39,42
RSELB2: IC449.10(C:OE) IC453.10(C:OE) IC457.10(C:OE) IC461.10(C:OE) ; also sheet 39,42
RSELB3: IC449.13(D:OE) IC453.13(D:OE) IC457.13(D:OE) IC461.13(D:OE) ; also sheet 39,42
RSELB4: IC450.1(A:OE) IC454.1(A:OE) IC458.1(A:OE) IC462.1(A:OE) ; also sheet 39
RSELB5: IC450.4(B:OE) IC454.4(B:OE) IC458.4(B:OE) IC462.4(B:OE) ; also sheet 39,42
RSELB6: IC450.10(C:OE) IC454.10(C:OE) IC458.10(C:OE) IC462.10(C:OE) ; also sheet 39,42
RSELB7: IC450.13(D:OE) IC454.13(D:OE) IC458.13(D:OE) IC462.13(D:OE) ; also sheet 39,42
RSELB8: IC451.1(A:OE) IC455.1(A:OE) IC459.1(A:OE) IC463.1(A:OE) ; also sheet 39,42
RSELB9: IC451.4(B:OE) IC455.4(B:OE) IC459.4(B:OE) IC463.4(B:OE) ; also sheet 39,42
RSELB10: IC451.10(C:OE) IC455.10(C:OE) IC459.10(C:OE) IC463.10(C:OE) ; also sheet 39,42
RSELB11: IC451.13(D:OE) IC455.13(D:OE) IC459.13(D:OE) IC463.13(D:OE) ; also sheet 39,42
RSELB12: IC452.1(A:OE) IC456.1(A:OE) IC460.1(A:OE) IC464.1(A:OE) ; also sheet 39,42
RSELB13: IC452.4(B:OE) IC456.4(B:OE) IC460.4(B:OE) IC464.4(B:OE) ; also sheet 39,42
RSELB14: IC452.10(C:OE) IC456.10(C:OE) IC460.10(C:OE) IC464.10(C:OE) ; also sheet 39,42
RSELB15: IC452.13(D:OE) IC456.13(D:OE) IC460.13(D:OE) IC464.13(D:OE) ; also sheet 39,42
VCC: IC449.14(P:VCC) IC450.14(P:VCC) IC451.14(P:VCC) IC452.14(P:VCC) IC453.14(P:VCC) IC454.14(P:VCC) IC455.14(P:VCC) IC456.14(P:VCC) IC457.14(P:VCC) IC458.14(P:VCC) IC459.14(P:VCC) IC460.14(P:VCC) IC461.14(P:VCC) IC462.14(P:VCC) IC463.14(P:VCC) IC464.14(P:VCC) ; also sheet 1,2,3,4,5,6,7,8,9,10,11,12,13,14,15,16,17,18,19,20,21,22,23,24,25,26,27,28,29,30,31,32,33,34,37,38,39,40,41,42,44,45,46,47

### Buses
B[0..7]
REG0_[0..7]
REG1_[0..7]
REG3_[0..7]
REG4_[0..7]
REG5_[0..7]
REG6_[0..7]
REG7_[0..7]
REG8_[0..7]
REG9_[0..7]
REG10_[0..7]
REG11_[0..7]
REG12_[0..7]
REG13_[0..7]
REG14_[0..7]
REG15_[0..7]
REG2_[0..7]

## Sheet 44 of 48
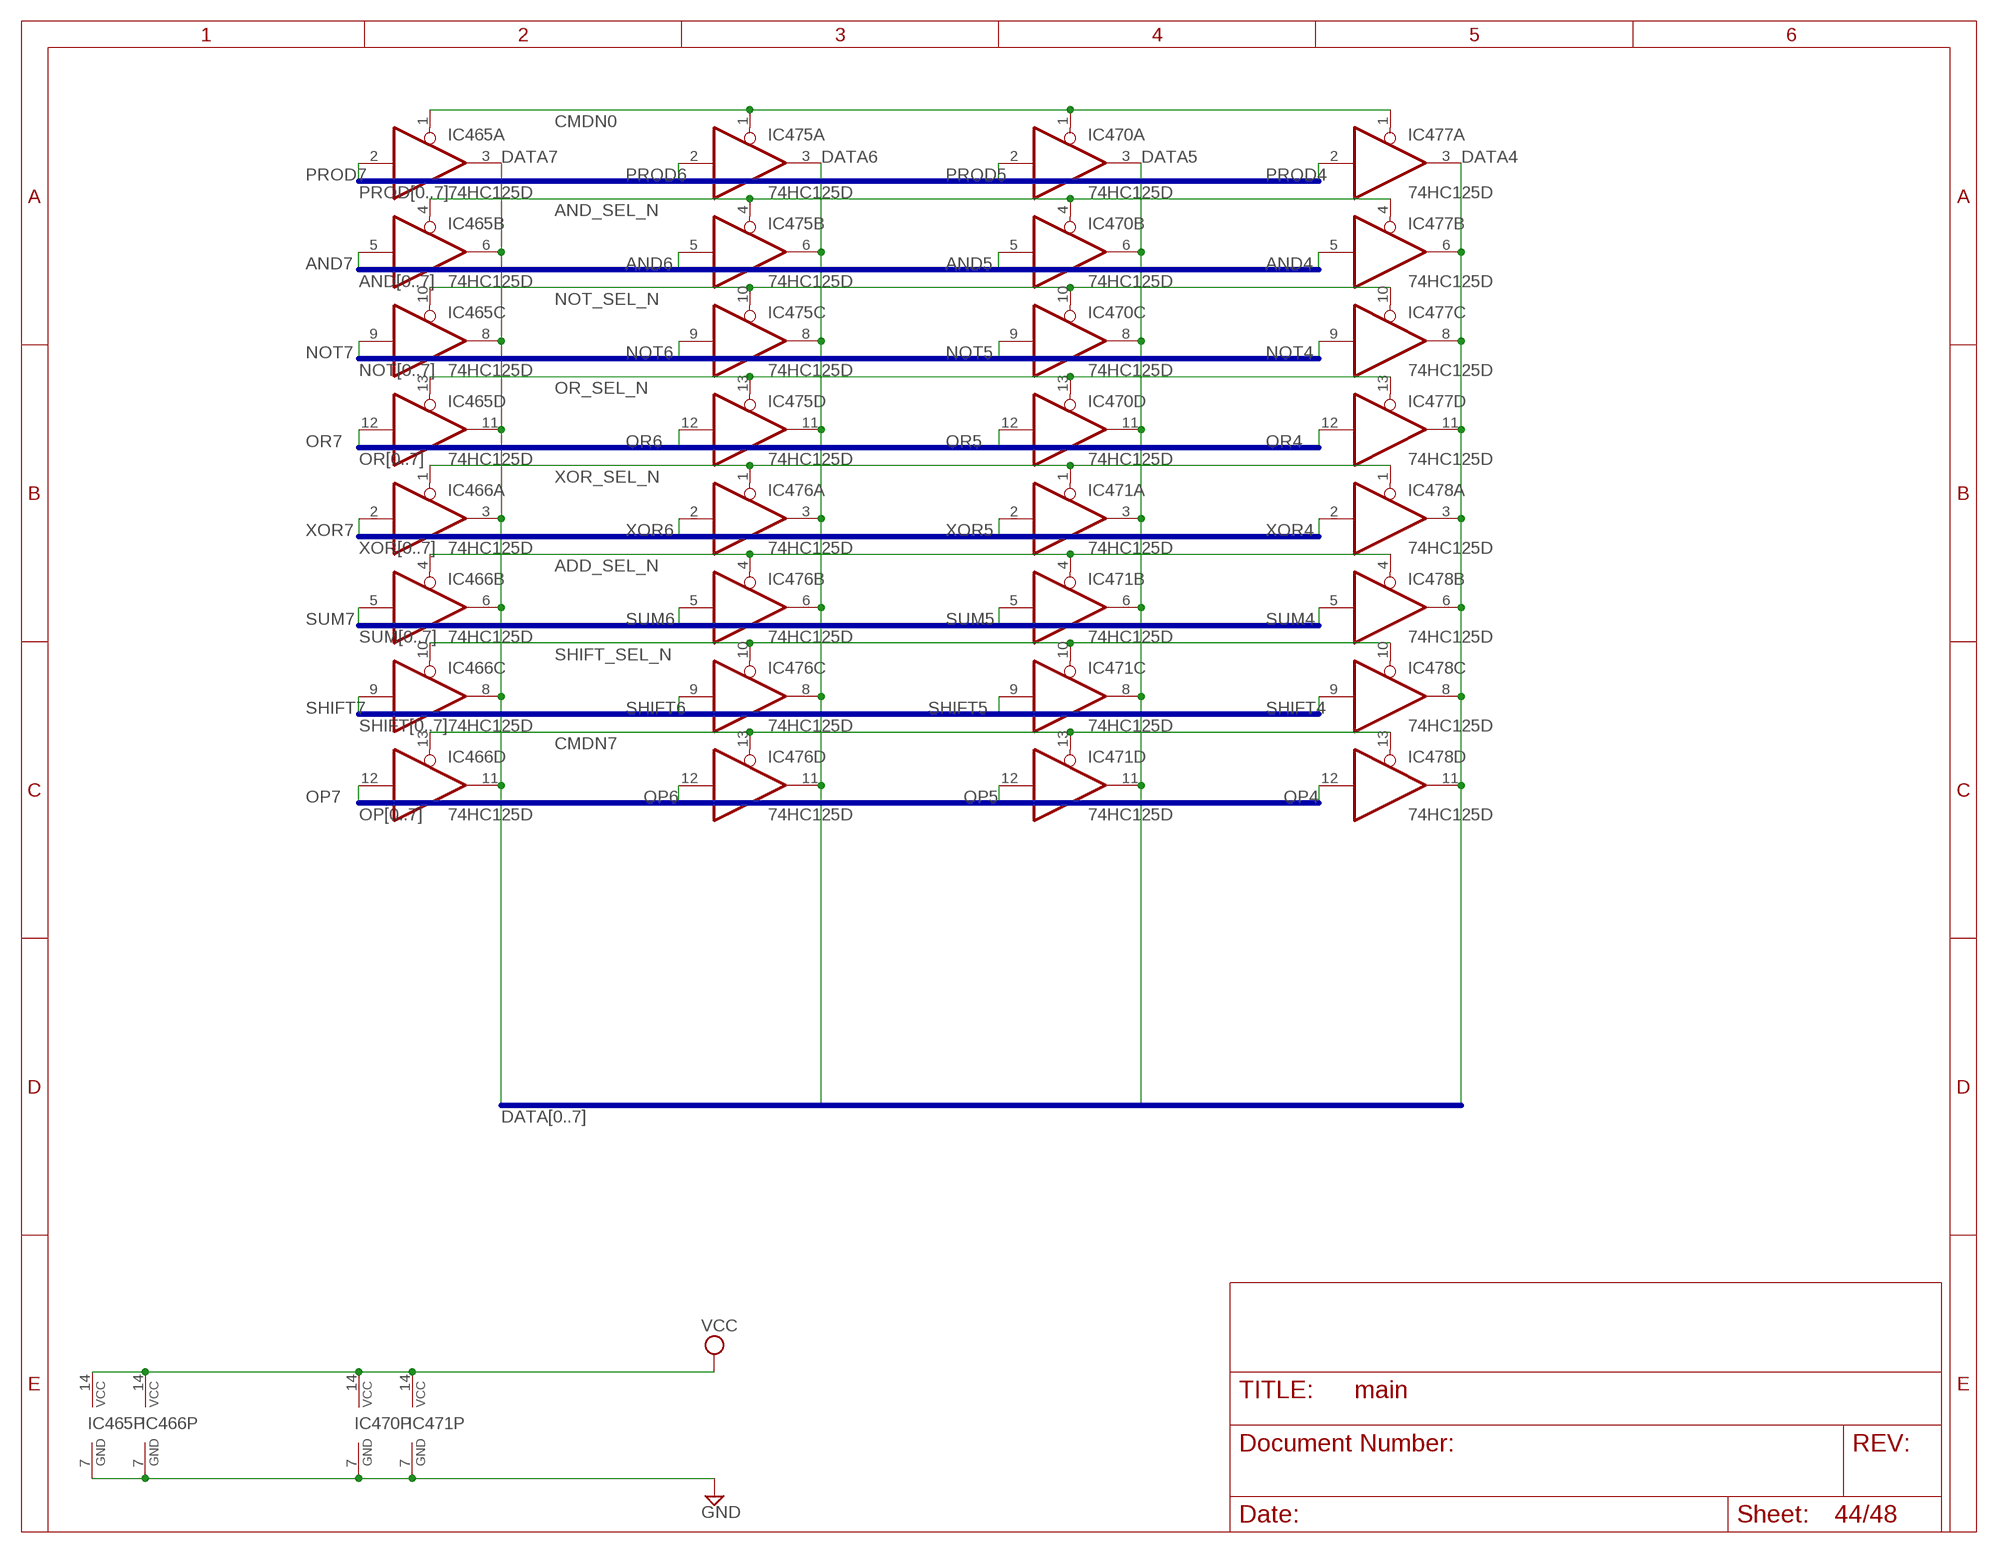
[diagram p42: schematic, sheet 44]

### Parts
IC465  74HC125D  [SO14]
IC466  74HC125D  [SO14]
IC470  74HC125D  [SO14]
IC471  74HC125D  [SO14]
IC475  74HC125D  [SO14]
IC476  74HC125D  [SO14]
IC477  74HC125D  [SO14]
IC478  74HC125D  [SO14]

### Nets
ADD_SEL_N: IC466.4(B:OE) IC471.4(B:OE) IC476.4(B:OE) IC478.4(B:OE) ; also sheet 45,46
AND4: IC477.5(B:I) ; also sheet 24
AND5: IC470.5(B:I) ; also sheet 24
AND6: IC475.5(B:I) ; also sheet 24
AND7: IC465.5(B:I) ; also sheet 24
AND_SEL_N: IC465.4(B:OE) IC470.4(B:OE) IC475.4(B:OE) IC477.4(B:OE) ; also sheet 37,45,46
CMDN0: IC465.1(A:OE) IC470.1(A:OE) IC475.1(A:OE) IC477.1(A:OE) ; also sheet 37,45,46
CMDN7: IC466.13(D:OE) IC471.13(D:OE) IC476.13(D:OE) IC478.13(D:OE) ; also sheet 37,45,46
DATA4: IC477.3(A:O) IC477.6(B:O) IC477.8(C:O) IC477.11(D:O) IC478.3(A:O) IC478.6(B:O) IC478.8(C:O) IC478.11(D:O)
DATA5: IC470.3(A:O) IC470.6(B:O) IC470.8(C:O) IC470.11(D:O) IC471.3(A:O) IC471.6(B:O) IC471.8(C:O) IC471.11(D:O)
DATA6: IC475.3(A:O) IC475.6(B:O) IC475.8(C:O) IC475.11(D:O) IC476.3(A:O) IC476.6(B:O) IC476.8(C:O) IC476.11(D:O)
DATA7: IC465.3(A:O) IC465.6(B:O) IC465.8(C:O) IC465.11(D:O) IC466.3(A:O) IC466.6(B:O) IC466.8(C:O) IC466.11(D:O)
GND: IC465.7(P:GND) IC466.7(P:GND) IC470.7(P:GND) IC471.7(P:GND) ; also sheet 1,2,3,4,5,6,7,8,9,10,11,12,13,14,15,16,17,18,19,20,21,22,23,24,25,26,27,28,29,30,31,32,33,34,37,38,39,40,41,42,43,45,46,47
NOT4: IC477.9(C:I) ; also sheet 24
NOT5: IC470.9(C:I) ; also sheet 24
NOT6: IC475.9(C:I) ; also sheet 24
NOT7: IC465.9(C:I) ; also sheet 24
NOT_SEL_N: IC465.10(C:OE) IC470.10(C:OE) IC475.10(C:OE) IC477.10(C:OE) ; also sheet 37,45,46
OP4: IC478.12(D:I) ; also sheet 38,47
OP5: IC471.12(D:I) ; also sheet 38,47
OP6: IC476.12(D:I) ; also sheet 38,47
OP7: IC466.12(D:I) ; also sheet 38,47
OR4: IC477.12(D:I) ; also sheet 24
OR5: IC470.12(D:I) ; also sheet 24
OR6: IC475.12(D:I) ; also sheet 24
OR7: IC465.12(D:I) ; also sheet 24
OR_SEL_N: IC465.13(D:OE) IC470.13(D:OE) IC475.13(D:OE) IC477.13(D:OE) ; also sheet 37,45,46
PROD4: IC477.2(A:I) ; also sheet 22
PROD5: IC470.2(A:I) ; also sheet 22
PROD6: IC475.2(A:I) ; also sheet 19
PROD7: IC465.2(A:I) ; also sheet 21
SHIFT4: IC478.9(C:I) ; also sheet 30
SHIFT5: IC471.9(C:I) ; also sheet 30
SHIFT6: IC476.9(C:I) ; also sheet 30
SHIFT7: IC466.9(C:I) ; also sheet 30
SHIFT_SEL_N: IC466.10(C:OE) IC471.10(C:OE) IC476.10(C:OE) IC478.10(C:OE) ; also sheet 37,45,46
SUM4: IC478.5(B:I) ; also sheet 27,29
SUM5: IC471.5(B:I) ; also sheet 27,29
SUM6: IC476.5(B:I) ; also sheet 27,29
SUM7: IC466.5(B:I) ; also sheet 27,29
VCC: IC465.14(P:VCC) IC466.14(P:VCC) IC470.14(P:VCC) IC471.14(P:VCC) ; also sheet 1,2,3,4,5,6,7,8,9,10,11,12,13,14,15,16,17,18,19,20,21,22,23,24,25,26,27,28,29,30,31,32,33,34,37,38,39,40,41,42,43,45,46,47
XOR4: IC478.2(A:I) ; also sheet 25
XOR5: IC471.2(A:I) ; also sheet 25
XOR6: IC476.2(A:I) ; also sheet 25
XOR7: IC466.2(A:I) ; also sheet 25
XOR_SEL_N: IC466.1(A:OE) IC471.1(A:OE) IC476.1(A:OE) IC478.1(A:OE) ; also sheet 37,45,46

### Buses
DATA[0..7]
PROD[0..7]
AND[0..7]
NOT[0..7]
OR[0..7]
XOR[0..7]
SUM[0..7]
SHIFT[0..7]
OP[0..7]

## Sheet 45 of 48
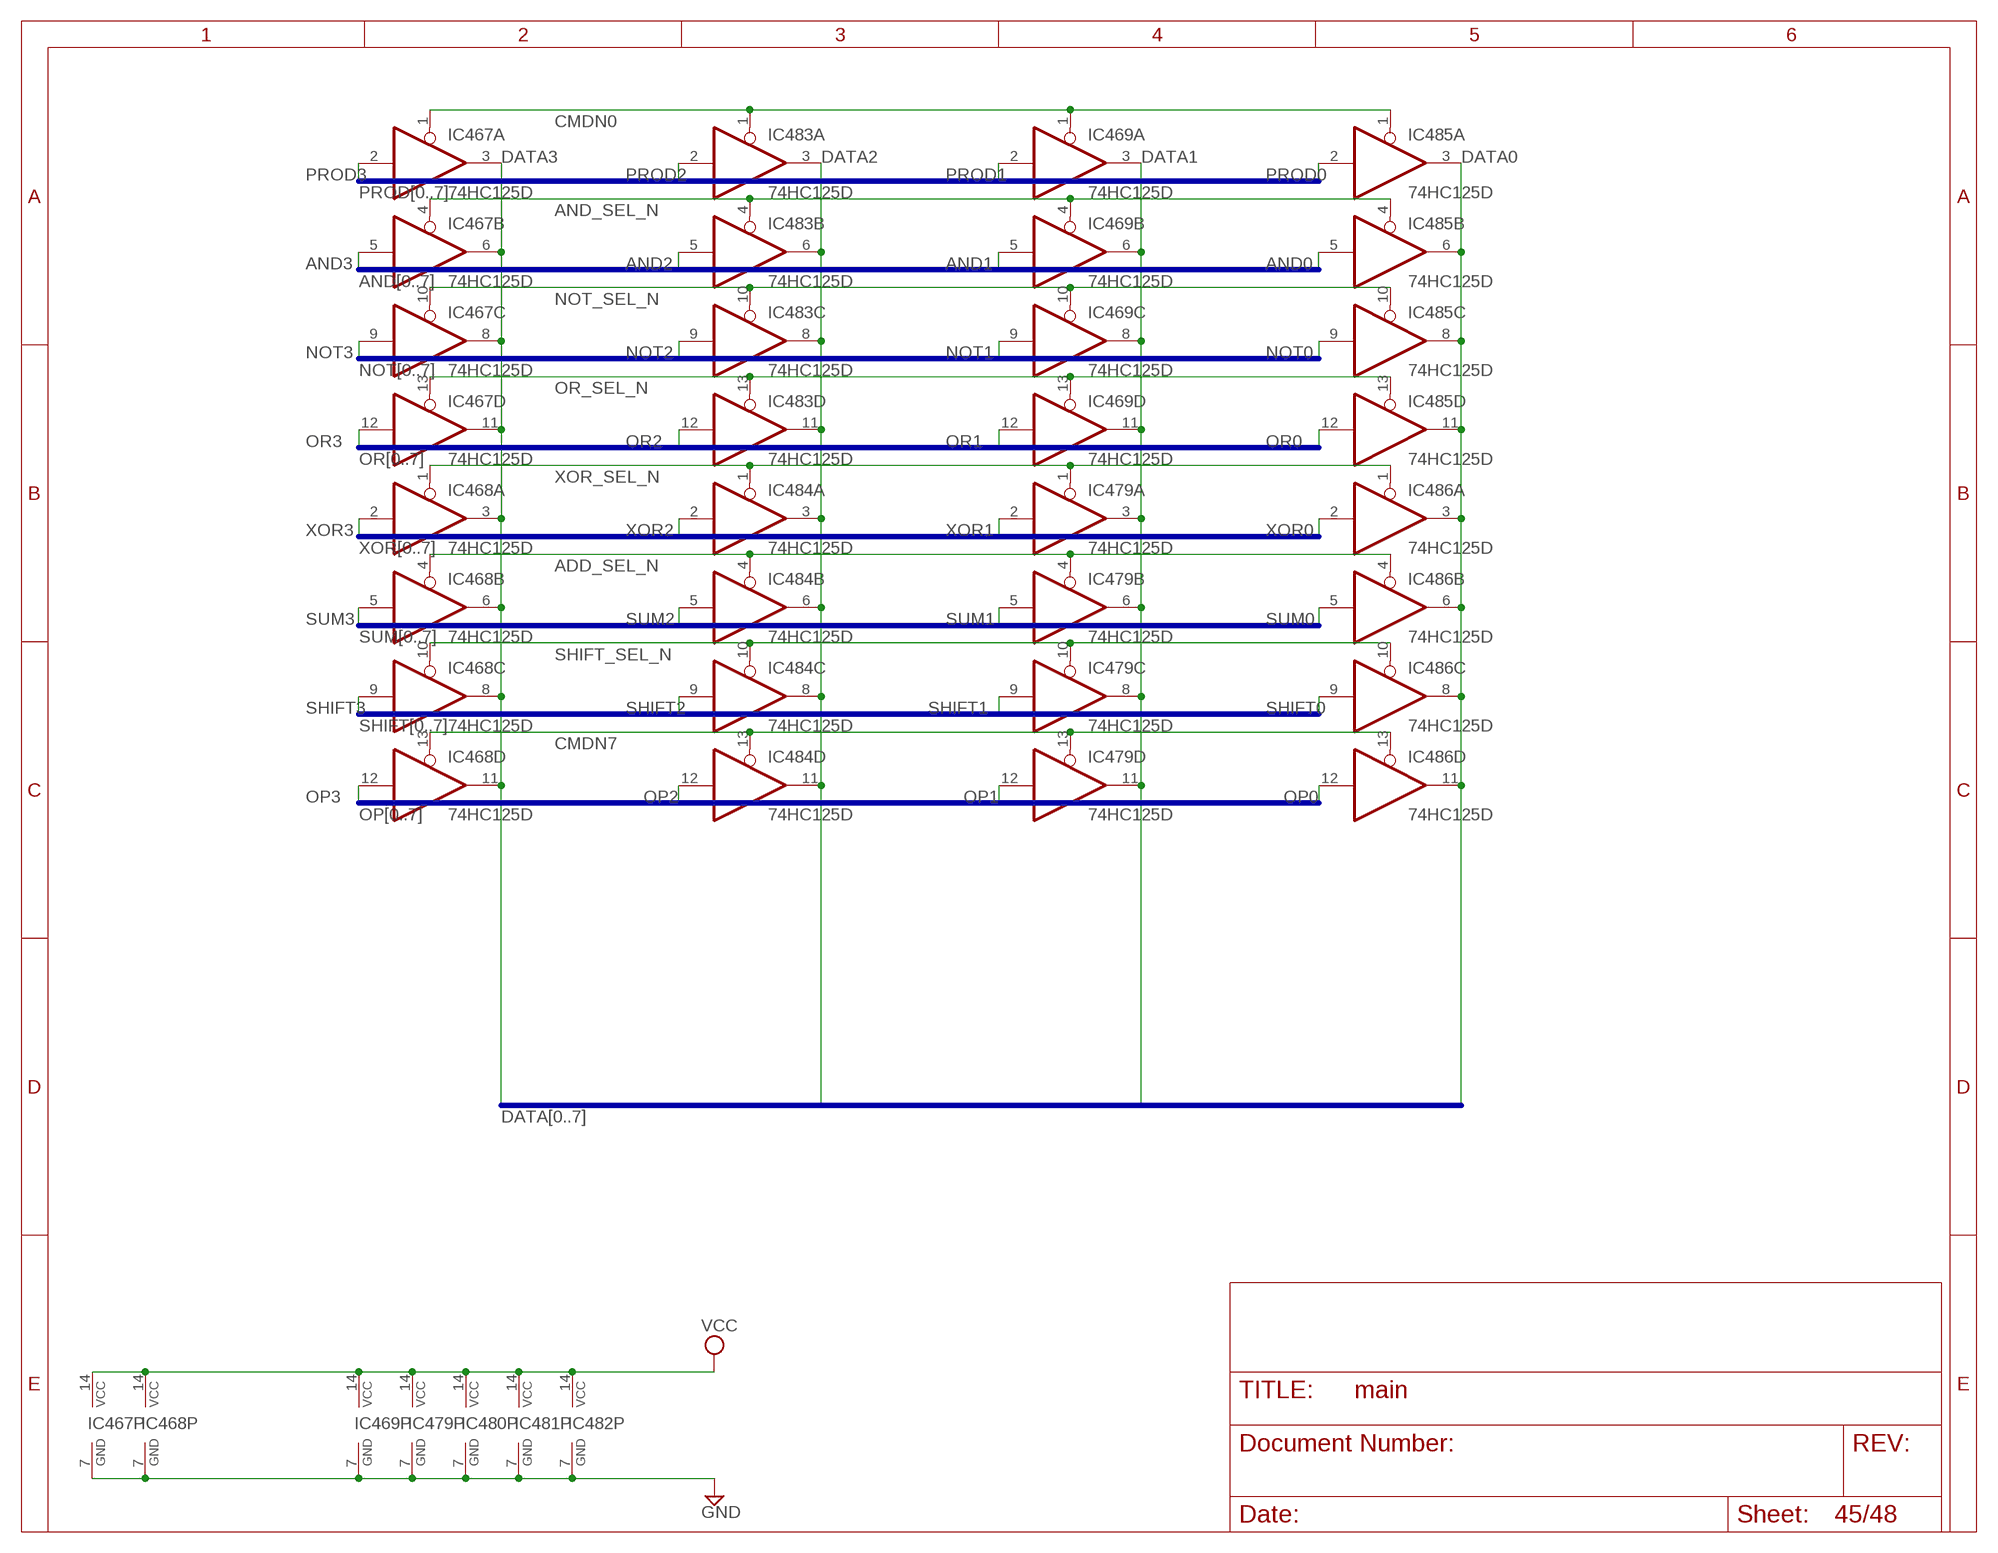
[diagram p43: schematic, sheet 45]

### Parts
IC467  74HC125D  [SO14]
IC468  74HC125D  [SO14]
IC469  74HC125D  [SO14]
IC479  74HC125D  [SO14]
IC480  74HC125D  [SO14]
IC481  74HC125D  [SO14]
IC482  74HC125D  [SO14]
IC483  74HC125D  [SO14]
IC484  74HC125D  [SO14]
IC485  74HC125D  [SO14]
IC486  74HC125D  [SO14]

### Nets
ADD_SEL_N: IC468.4(B:OE) IC479.4(B:OE) IC484.4(B:OE) IC486.4(B:OE) ; also sheet 44,46
AND0: IC485.5(B:I) ; also sheet 24
AND1: IC469.5(B:I) ; also sheet 24
AND2: IC483.5(B:I) ; also sheet 24
AND3: IC467.5(B:I) ; also sheet 24
AND_SEL_N: IC467.4(B:OE) IC469.4(B:OE) IC483.4(B:OE) IC485.4(B:OE) ; also sheet 37,44,46
CMDN0: IC467.1(A:OE) IC469.1(A:OE) IC483.1(A:OE) IC485.1(A:OE) ; also sheet 37,44,46
CMDN7: IC468.13(D:OE) IC479.13(D:OE) IC484.13(D:OE) IC486.13(D:OE) ; also sheet 37,44,46
DATA0: IC485.3(A:O) IC485.6(B:O) IC485.8(C:O) IC485.11(D:O) IC486.3(A:O) IC486.6(B:O) IC486.8(C:O) IC486.11(D:O)
DATA1: IC469.3(A:O) IC469.6(B:O) IC469.8(C:O) IC469.11(D:O) IC479.3(A:O) IC479.6(B:O) IC479.8(C:O) IC479.11(D:O)
DATA2: IC483.3(A:O) IC483.6(B:O) IC483.8(C:O) IC483.11(D:O) IC484.3(A:O) IC484.6(B:O) IC484.8(C:O) IC484.11(D:O)
DATA3: IC467.3(A:O) IC467.6(B:O) IC467.8(C:O) IC467.11(D:O) IC468.3(A:O) IC468.6(B:O) IC468.8(C:O) IC468.11(D:O)
GND: IC467.7(P:GND) IC468.7(P:GND) IC469.7(P:GND) IC479.7(P:GND) IC480.7(P:GND) IC481.7(P:GND) IC482.7(P:GND) ; also sheet 1,2,3,4,5,6,7,8,9,10,11,12,13,14,15,16,17,18,19,20,21,22,23,24,25,26,27,28,29,30,31,32,33,34,37,38,39,40,41,42,43,44,46,47
NOT0: IC485.9(C:I) ; also sheet 24
NOT1: IC469.9(C:I) ; also sheet 24
NOT2: IC483.9(C:I) ; also sheet 24
NOT3: IC467.9(C:I) ; also sheet 24
NOT_SEL_N: IC467.10(C:OE) IC469.10(C:OE) IC483.10(C:OE) IC485.10(C:OE) ; also sheet 37,44,46
OP0: IC486.12(D:I) ; also sheet 29,30,39,46,47
OP1: IC479.12(D:I) ; also sheet 29,30,39,46,47
OP2: IC484.12(D:I) ; also sheet 29,30,37,39,46,47
OP3: IC468.12(D:I) ; also sheet 29,30,39,47
OR0: IC485.12(D:I) ; also sheet 24
OR1: IC469.12(D:I) ; also sheet 24
OR2: IC483.12(D:I) ; also sheet 24
OR3: IC467.12(D:I) ; also sheet 24
OR_SEL_N: IC467.13(D:OE) IC469.13(D:OE) IC483.13(D:OE) IC485.13(D:OE) ; also sheet 37,44,46
PROD0: IC485.2(A:I) ; also sheet 19
PROD1: IC469.2(A:I) ; also sheet 19
PROD2: IC483.2(A:I) ; also sheet 22
PROD3: IC467.2(A:I) ; also sheet 22
SHIFT0: IC486.9(C:I) ; also sheet 30
SHIFT1: IC479.9(C:I) ; also sheet 30
SHIFT2: IC484.9(C:I) ; also sheet 30
SHIFT3: IC468.9(C:I) ; also sheet 30
SHIFT_SEL_N: IC468.10(C:OE) IC479.10(C:OE) IC484.10(C:OE) IC486.10(C:OE) ; also sheet 37,44,46
SUM0: IC486.5(B:I) ; also sheet 26,29
SUM1: IC479.5(B:I) ; also sheet 26,29
SUM2: IC484.5(B:I) ; also sheet 26,29
SUM3: IC468.5(B:I) ; also sheet 26,29
VCC: IC467.14(P:VCC) IC468.14(P:VCC) IC469.14(P:VCC) IC479.14(P:VCC) IC480.14(P:VCC) IC481.14(P:VCC) IC482.14(P:VCC) ; also sheet 1,2,3,4,5,6,7,8,9,10,11,12,13,14,15,16,17,18,19,20,21,22,23,24,25,26,27,28,29,30,31,32,33,34,37,38,39,40,41,42,43,44,46,47
XOR0: IC486.2(A:I) ; also sheet 25
XOR1: IC479.2(A:I) ; also sheet 25
XOR2: IC484.2(A:I) ; also sheet 25
XOR3: IC468.2(A:I) ; also sheet 25
XOR_SEL_N: IC468.1(A:OE) IC479.1(A:OE) IC484.1(A:OE) IC486.1(A:OE) ; also sheet 37,44,46
Unconnected: IC480.1(A:OE) IC480.2(A:I) IC480.3(A:O) IC480.4(B:OE) IC480.5(B:I) IC480.6(B:O) IC480.8(C:O) IC480.9(C:I) IC480.10(C:OE) IC480.11(D:O) IC480.12(D:I) IC480.13(D:OE) IC481.1(A:OE) IC481.2(A:I) IC481.3(A:O) IC481.4(B:OE) IC481.5(B:I) IC481.6(B:O) IC481.8(C:O) IC481.9(C:I) IC481.10(C:OE) IC481.11(D:O) IC481.12(D:I) IC481.13(D:OE) IC482.1(A:OE) IC482.2(A:I) IC482.3(A:O) IC482.4(B:OE) IC482.5(B:I) IC482.6(B:O) IC482.8(C:O) IC482.9(C:I) IC482.10(C:OE) IC482.11(D:O) IC482.12(D:I) IC482.13(D:OE)

### Buses
DATA[0..7]
PROD[0..7]
AND[0..7]
NOT[0..7]
OR[0..7]
XOR[0..7]
SUM[0..7]
SHIFT[0..7]
OP[0..7]

## Sheet 46 of 48
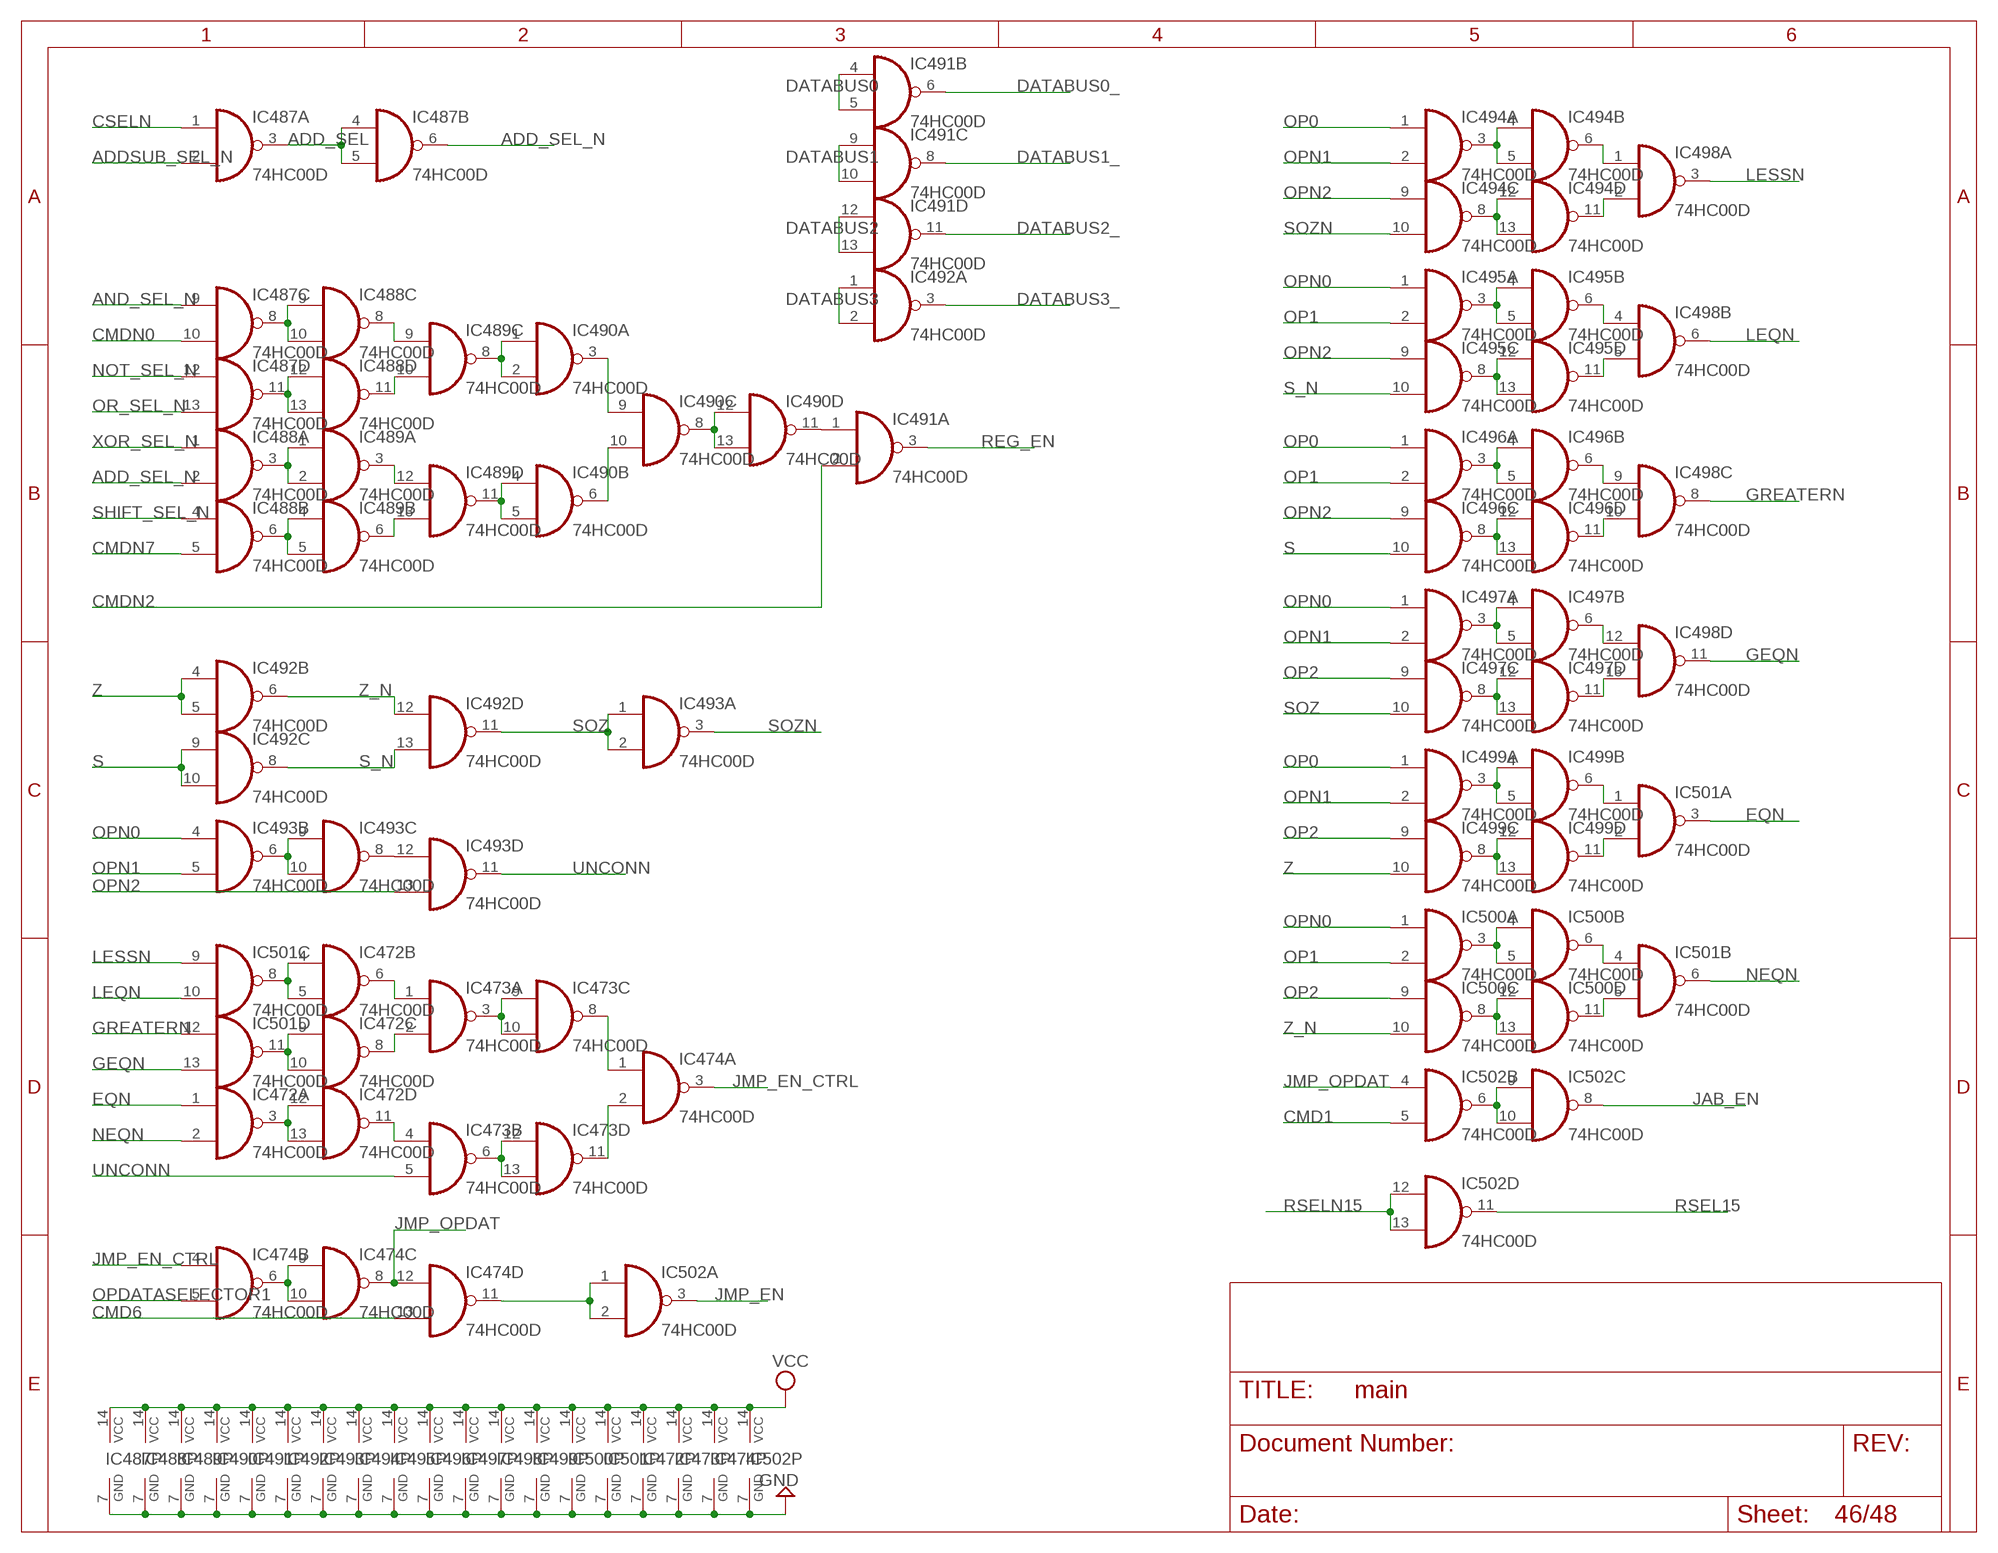
[diagram p44: schematic, sheet 46]

### Parts
IC472  74HC00D  [SO14]
IC473  74HC00D  [SO14]
IC474  74HC00D  [SO14]
IC487  74HC00D  [SO14]
IC488  74HC00D  [SO14]
IC489  74HC00D  [SO14]
IC490  74HC00D  [SO14]
IC491  74HC00D  [SO14]
IC492  74HC00D  [SO14]
IC493  74HC00D  [SO14]
IC494  74HC00D  [SO14]
IC495  74HC00D  [SO14]
IC496  74HC00D  [SO14]
IC497  74HC00D  [SO14]
IC498  74HC00D  [SO14]
IC499  74HC00D  [SO14]
IC500  74HC00D  [SO14]
IC501  74HC00D  [SO14]
IC502  74HC00D  [SO14]

### Nets
ADD_SEL: IC487.3(A:O) IC487.4(B:I0) IC487.5(B:I1)
ADD_SEL_N: IC487.6(B:O) IC488.2(A:I1) ; also sheet 44,45
ADDSUB_SEL_N: IC487.2(A:I1) ; also sheet 37
AND_SEL_N: IC487.9(C:I0) ; also sheet 37,44,45
CMD1: IC502.5(B:I1) ; also sheet 37
CMD6: IC474.13(D:I1) ; also sheet 37
CMDN0: IC487.10(C:I1) ; also sheet 37,44,45
CMDN2: IC491.2(A:I1) ; also sheet 34,37,47
CMDN7: IC488.5(B:I1) ; also sheet 37,44,45
CSELN: IC487.1(A:I0) ; also sheet 37
DATABUS0: IC491.4(B:I0) IC491.5(B:I1)
DATABUS0_: IC491.6(B:O)
DATABUS1: IC491.9(C:I0) IC491.10(C:I1)
DATABUS1_: IC491.8(C:O)
DATABUS2: IC491.12(D:I0) IC491.13(D:I1)
DATABUS2_: IC491.11(D:O)
DATABUS3: IC492.1(A:I0) IC492.2(A:I1)
DATABUS3_: IC492.3(A:O)
EQN: IC472.1(A:I0) IC501.3(A:O)
GEQN: IC498.11(D:O) IC501.13(D:I1)
GND: IC472.7(P:GND) IC473.7(P:GND) IC474.7(P:GND) IC487.7(P:GND) IC488.7(P:GND) IC489.7(P:GND) IC490.7(P:GND) IC491.7(P:GND) IC492.7(P:GND) IC493.7(P:GND) IC494.7(P:GND) IC495.7(P:GND) IC496.7(P:GND) IC497.7(P:GND) IC498.7(P:GND) IC499.7(P:GND) IC500.7(P:GND) IC501.7(P:GND) IC502.7(P:GND) ; also sheet 1,2,3,4,5,6,7,8,9,10,11,12,13,14,15,16,17,18,19,20,21,22,23,24,25,26,27,28,29,30,31,32,33,34,37,38,39,40,41,42,43,44,45,47
GREATERN: IC498.8(C:O) IC501.12(D:I0)
JAB_EN: IC502.8(C:O) ; also sheet 34
JMP_EN: IC502.3(A:O) ; also sheet 29
JMP_EN_CTRL: IC474.3(A:O) IC474.4(B:I0)
JMP_OPDAT: IC474.8(C:O) IC474.12(D:I0) IC502.4(B:I0)
LEQN: IC498.6(B:O) IC501.10(C:I1)
LESSN: IC498.3(A:O) IC501.9(C:I0)
N$917: IC487.11(D:O) IC488.12(D:I0) IC488.13(D:I1)
N$963: IC487.8(C:O) IC488.9(C:I0) IC488.10(C:I1)
N$966: IC488.6(B:O) IC489.4(B:I0) IC489.5(B:I1)
N$967: IC489.6(B:O) IC489.13(D:I1)
N$968: IC488.3(A:O) IC489.1(A:I0) IC489.2(A:I1)
N$1027: IC489.3(A:O) IC489.12(D:I0)
N$1028: IC488.11(D:O) IC489.10(C:I1)
N$1031: IC488.8(C:O) IC489.9(C:I0)
N$1033: IC489.8(C:O) IC490.1(A:I0) IC490.2(A:I1)
N$1034: IC489.11(D:O) IC490.4(B:I0) IC490.5(B:I1)
N$1067: IC490.3(A:O) IC490.9(C:I0)
N$1068: IC490.6(B:O) IC490.10(C:I1)
N$1069: IC490.8(C:O) IC490.12(D:I0) IC490.13(D:I1)
N$1070: IC490.11(D:O) IC491.1(A:I0)
N$1071: IC493.8(C:O) IC493.12(D:I0)
N$1072: IC499.6(B:O) IC501.1(A:I0)
N$1073: IC499.11(D:O) IC501.2(A:I1)
N$1074: IC493.6(B:O) IC493.9(C:I0) IC493.10(C:I1)
N$1075: IC494.3(A:O) IC494.4(B:I0) IC494.5(B:I1)
N$1076: IC494.8(C:O) IC494.12(D:I0) IC494.13(D:I1)
N$1077: IC494.11(D:O) IC498.2(A:I1)
N$1078: IC494.6(B:O) IC498.1(A:I0)
N$1079: IC495.6(B:O) IC498.4(B:I0)
N$1080: IC495.11(D:O) IC498.5(B:I1)
N$1081: IC495.8(C:O) IC495.12(D:I0) IC495.13(D:I1)
N$1082: IC495.3(A:O) IC495.4(B:I0) IC495.5(B:I1)
N$1083: IC496.3(A:O) IC496.4(B:I0) IC496.5(B:I1)
N$1084: IC496.8(C:O) IC496.12(D:I0) IC496.13(D:I1)
N$1085: IC496.6(B:O) IC498.9(C:I0)
N$1086: IC496.11(D:O) IC498.10(C:I1)
N$1087: IC497.6(B:O) IC498.12(D:I0)
N$1088: IC497.11(D:O) IC498.13(D:I1)
N$1089: IC497.8(C:O) IC497.12(D:I0) IC497.13(D:I1)
N$1090: IC497.3(A:O) IC497.4(B:I0) IC497.5(B:I1)
N$1091: IC500.6(B:O) IC501.4(B:I0)
N$1092: IC500.11(D:O) IC501.5(B:I1)
N$1093: IC500.8(C:O) IC500.12(D:I0) IC500.13(D:I1)
N$1094: IC500.3(A:O) IC500.4(B:I0) IC500.5(B:I1)
N$1095: IC499.8(C:O) IC499.12(D:I0) IC499.13(D:I1)
N$1096: IC499.3(A:O) IC499.4(B:I0) IC499.5(B:I1)
N$1097: IC472.4(B:I0) IC472.5(B:I1) IC501.8(C:O)
N$1098: IC472.9(C:I0) IC472.10(C:I1) IC501.11(D:O)
N$1099: IC472.6(B:O) IC473.1(A:I0)
N$1100: IC472.3(A:O) IC472.12(D:I0) IC472.13(D:I1)
N$1101: IC472.11(D:O) IC473.4(B:I0)
N$1102: IC472.8(C:O) IC473.2(A:I1)
N$1103: IC473.3(A:O) IC473.9(C:I0) IC473.10(C:I1)
N$1104: IC473.8(C:O) IC474.1(A:I0)
N$1105: IC473.11(D:O) IC474.2(A:I1)
N$1106: IC473.6(B:O) IC473.12(D:I0) IC473.13(D:I1)
N$1108: IC474.6(B:O) IC474.9(C:I0) IC474.10(C:I1)
N$1110: IC502.6(B:O) IC502.9(C:I0) IC502.10(C:I1)
N$1112: IC474.11(D:O) IC502.1(A:I0) IC502.2(A:I1)
NEQN: IC472.2(A:I1) IC501.6(B:O)
NOT_SEL_N: IC487.12(D:I0) ; also sheet 37,44,45
OP0: IC494.1(A:I0) IC496.1(A:I0) IC499.1(A:I0) ; also sheet 29,30,39,45,47
OP1: IC495.2(A:I1) IC496.2(A:I1) IC500.2(A:I1) ; also sheet 29,30,39,45,47
OP2: IC497.9(C:I0) IC499.9(C:I0) IC500.9(C:I0) ; also sheet 29,30,37,39,45,47
OPDATASELECTOR1: IC474.5(B:I1) ; also sheet 34
OPN0: IC493.4(B:I0) IC495.1(A:I0) IC497.1(A:I0) IC500.1(A:I0) ; also sheet 30,39
OPN1: IC493.5(B:I1) IC494.2(A:I1) IC497.2(A:I1) IC499.2(A:I1) ; also sheet 30,39
OPN2: IC493.13(D:I1) IC494.9(C:I0) IC495.9(C:I0) IC496.9(C:I0) ; also sheet 30,37,39
OR_SEL_N: IC487.13(D:I1) ; also sheet 37,44,45
REG_EN: IC491.3(A:O) ; also sheet 36
RSEL15: IC502.11(D:O) ; also sheet 48
RSELN15: IC502.12(D:I0) IC502.13(D:I1) ; also sheet 36
S: IC492.9(C:I0) IC492.10(C:I1) IC496.10(C:I1)
S_N: IC492.8(C:O) IC492.13(D:I1) IC495.10(C:I1)
SHIFT_SEL_N: IC488.4(B:I0) ; also sheet 37,44,45
SOZ: IC492.11(D:O) IC493.1(A:I0) IC493.2(A:I1) IC497.10(C:I1)
SOZN: IC493.3(A:O) IC494.10(C:I1)
UNCONN: IC473.5(B:I1) IC493.11(D:O)
VCC: IC472.14(P:VCC) IC473.14(P:VCC) IC474.14(P:VCC) IC487.14(P:VCC) IC488.14(P:VCC) IC489.14(P:VCC) IC490.14(P:VCC) IC491.14(P:VCC) IC492.14(P:VCC) IC493.14(P:VCC) IC494.14(P:VCC) IC495.14(P:VCC) IC496.14(P:VCC) IC497.14(P:VCC) IC498.14(P:VCC) IC499.14(P:VCC) IC500.14(P:VCC) IC501.14(P:VCC) IC502.14(P:VCC) ; also sheet 1,2,3,4,5,6,7,8,9,10,11,12,13,14,15,16,17,18,19,20,21,22,23,24,25,26,27,28,29,30,31,32,33,34,37,38,39,40,41,42,43,44,45,47
XOR_SEL_N: IC488.1(A:I0) ; also sheet 37,44,45
Z: IC492.4(B:I0) IC492.5(B:I1) IC499.10(C:I1) ; also sheet 29
Z_N: IC492.6(B:O) IC492.12(D:I0) IC500.10(C:I1)

## Sheet 47 of 48
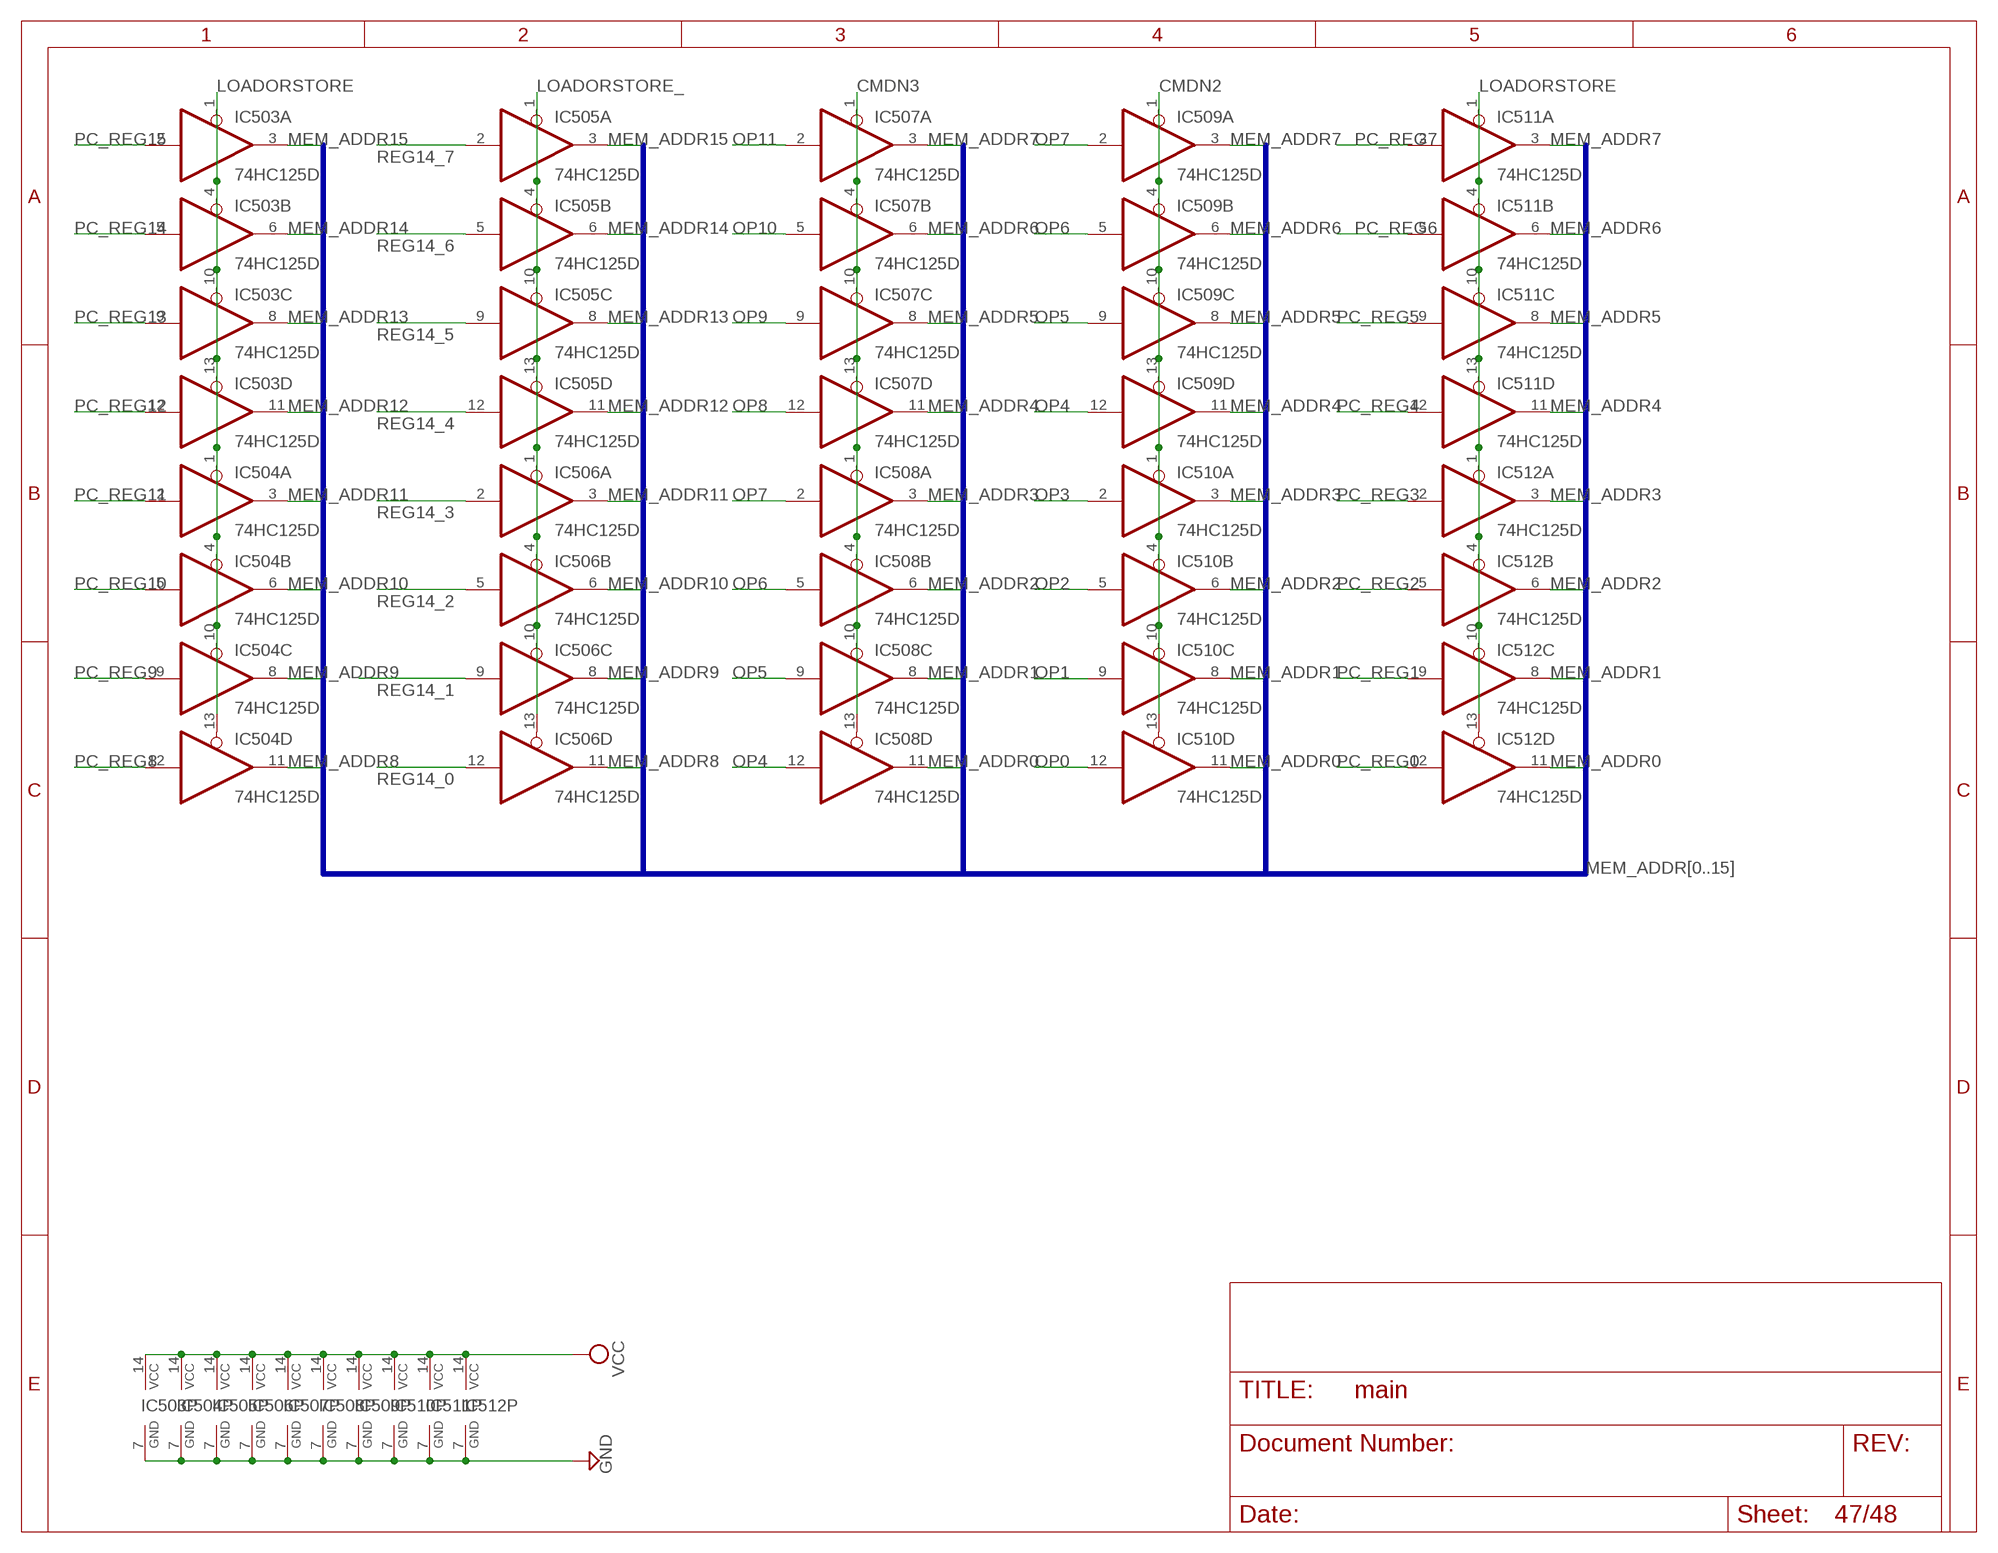
[diagram p45: schematic, sheet 47]

### Parts
IC503  74HC125D  [SO14]
IC504  74HC125D  [SO14]
IC505  74HC125D  [SO14]
IC506  74HC125D  [SO14]
IC507  74HC125D  [SO14]
IC508  74HC125D  [SO14]
IC509  74HC125D  [SO14]
IC510  74HC125D  [SO14]
IC511  74HC125D  [SO14]
IC512  74HC125D  [SO14]

### Nets
CMDN2: IC509.1(A:OE) IC509.4(B:OE) IC509.10(C:OE) IC509.13(D:OE) IC510.1(A:OE) IC510.4(B:OE) IC510.10(C:OE) IC510.13(D:OE) ; also sheet 34,37,46
CMDN3: IC507.1(A:OE) IC507.4(B:OE) IC507.10(C:OE) IC507.13(D:OE) IC508.1(A:OE) IC508.4(B:OE) IC508.10(C:OE) IC508.13(D:OE) ; also sheet 34,37
GND: IC503.7(P:GND) IC504.7(P:GND) IC505.7(P:GND) IC506.7(P:GND) IC507.7(P:GND) IC508.7(P:GND) IC509.7(P:GND) IC510.7(P:GND) IC511.7(P:GND) IC512.7(P:GND) ; also sheet 1,2,3,4,5,6,7,8,9,10,11,12,13,14,15,16,17,18,19,20,21,22,23,24,25,26,27,28,29,30,31,32,33,34,37,38,39,40,41,42,43,44,45,46
LOADORSTORE: IC503.1(A:OE) IC503.4(B:OE) IC503.10(C:OE) IC503.13(D:OE) IC504.1(A:OE) IC504.4(B:OE) IC504.10(C:OE) IC504.13(D:OE) IC511.1(A:OE) IC511.4(B:OE) IC511.10(C:OE) IC511.13(D:OE) IC512.1(A:OE) IC512.4(B:OE) IC512.10(C:OE) IC512.13(D:OE)
LOADORSTORE_: IC505.1(A:OE) IC505.4(B:OE) IC505.10(C:OE) IC505.13(D:OE) IC506.1(A:OE) IC506.4(B:OE) IC506.10(C:OE) IC506.13(D:OE)
MEM_ADDR0: IC508.11(D:O) IC510.11(D:O) IC512.11(D:O)
MEM_ADDR1: IC508.8(C:O) IC510.8(C:O) IC512.8(C:O)
MEM_ADDR2: IC508.6(B:O) IC510.6(B:O) IC512.6(B:O)
MEM_ADDR3: IC508.3(A:O) IC510.3(A:O) IC512.3(A:O)
MEM_ADDR4: IC507.11(D:O) IC509.11(D:O) IC511.11(D:O)
MEM_ADDR5: IC507.8(C:O) IC509.8(C:O) IC511.8(C:O)
MEM_ADDR6: IC507.6(B:O) IC509.6(B:O) IC511.6(B:O)
MEM_ADDR7: IC507.3(A:O) IC509.3(A:O) IC511.3(A:O)
MEM_ADDR8: IC504.11(D:O) IC506.11(D:O)
MEM_ADDR9: IC504.8(C:O) IC506.8(C:O)
MEM_ADDR10: IC504.6(B:O) IC506.6(B:O)
MEM_ADDR11: IC504.3(A:O) IC506.3(A:O)
MEM_ADDR12: IC503.11(D:O) IC505.11(D:O)
MEM_ADDR13: IC503.8(C:O) IC505.8(C:O)
MEM_ADDR14: IC503.6(B:O) IC505.6(B:O)
MEM_ADDR15: IC503.3(A:O) IC505.3(A:O)
OP0: IC510.12(D:I) ; also sheet 29,30,39,45,46
OP1: IC510.9(C:I) ; also sheet 29,30,39,45,46
OP2: IC510.5(B:I) ; also sheet 29,30,37,39,45,46
OP3: IC510.2(A:I) ; also sheet 29,30,39,45
OP4: IC508.12(D:I) IC509.12(D:I) ; also sheet 38,44
OP5: IC508.9(C:I) IC509.9(C:I) ; also sheet 38,44
OP6: IC508.5(B:I) IC509.5(B:I) ; also sheet 38,44
OP7: IC508.2(A:I) IC509.2(A:I) ; also sheet 38,44
OP8: IC507.12(D:I) ; also sheet 36
OP9: IC507.9(C:I) ; also sheet 36
OP10: IC507.5(B:I) ; also sheet 36
OP11: IC507.2(A:I) ; also sheet 34,36
PC_REG0: IC512.12(D:I) ; also sheet 31
PC_REG1: IC512.9(C:I) ; also sheet 31
PC_REG2: IC512.5(B:I) ; also sheet 31
PC_REG3: IC512.2(A:I) ; also sheet 31
PC_REG4: IC511.12(D:I) ; also sheet 31
PC_REG5: IC511.9(C:I) ; also sheet 31
PC_REG6: IC511.5(B:I) ; also sheet 31
PC_REG7: IC511.2(A:I) ; also sheet 31
PC_REG8: IC504.12(D:I) ; also sheet 32
PC_REG9: IC504.9(C:I) ; also sheet 32
PC_REG10: IC504.5(B:I) ; also sheet 32
PC_REG11: IC504.2(A:I) ; also sheet 32
PC_REG12: IC503.12(D:I) ; also sheet 32
PC_REG13: IC503.9(C:I) ; also sheet 32
PC_REG14: IC503.5(B:I) ; also sheet 32
PC_REG15: IC503.2(A:I) ; also sheet 32
REG14_0: IC506.12(D:I) ; also sheet 41,43
REG14_1: IC506.9(C:I) ; also sheet 41,43
REG14_2: IC506.5(B:I) ; also sheet 41,43
REG14_3: IC506.2(A:I) ; also sheet 41,43
REG14_4: IC505.12(D:I) ; also sheet 40,42
REG14_5: IC505.9(C:I) ; also sheet 40,42
REG14_6: IC505.5(B:I) ; also sheet 40,42
REG14_7: IC505.2(A:I) ; also sheet 40,42
VCC: IC503.14(P:VCC) IC504.14(P:VCC) IC505.14(P:VCC) IC506.14(P:VCC) IC507.14(P:VCC) IC508.14(P:VCC) IC509.14(P:VCC) IC510.14(P:VCC) IC511.14(P:VCC) IC512.14(P:VCC) ; also sheet 1,2,3,4,5,6,7,8,9,10,11,12,13,14,15,16,17,18,19,20,21,22,23,24,25,26,27,28,29,30,31,32,33,34,37,38,39,40,41,42,43,44,45,46

### Buses
MEM_ADDR[0..15]

## Sheet 48 of 48
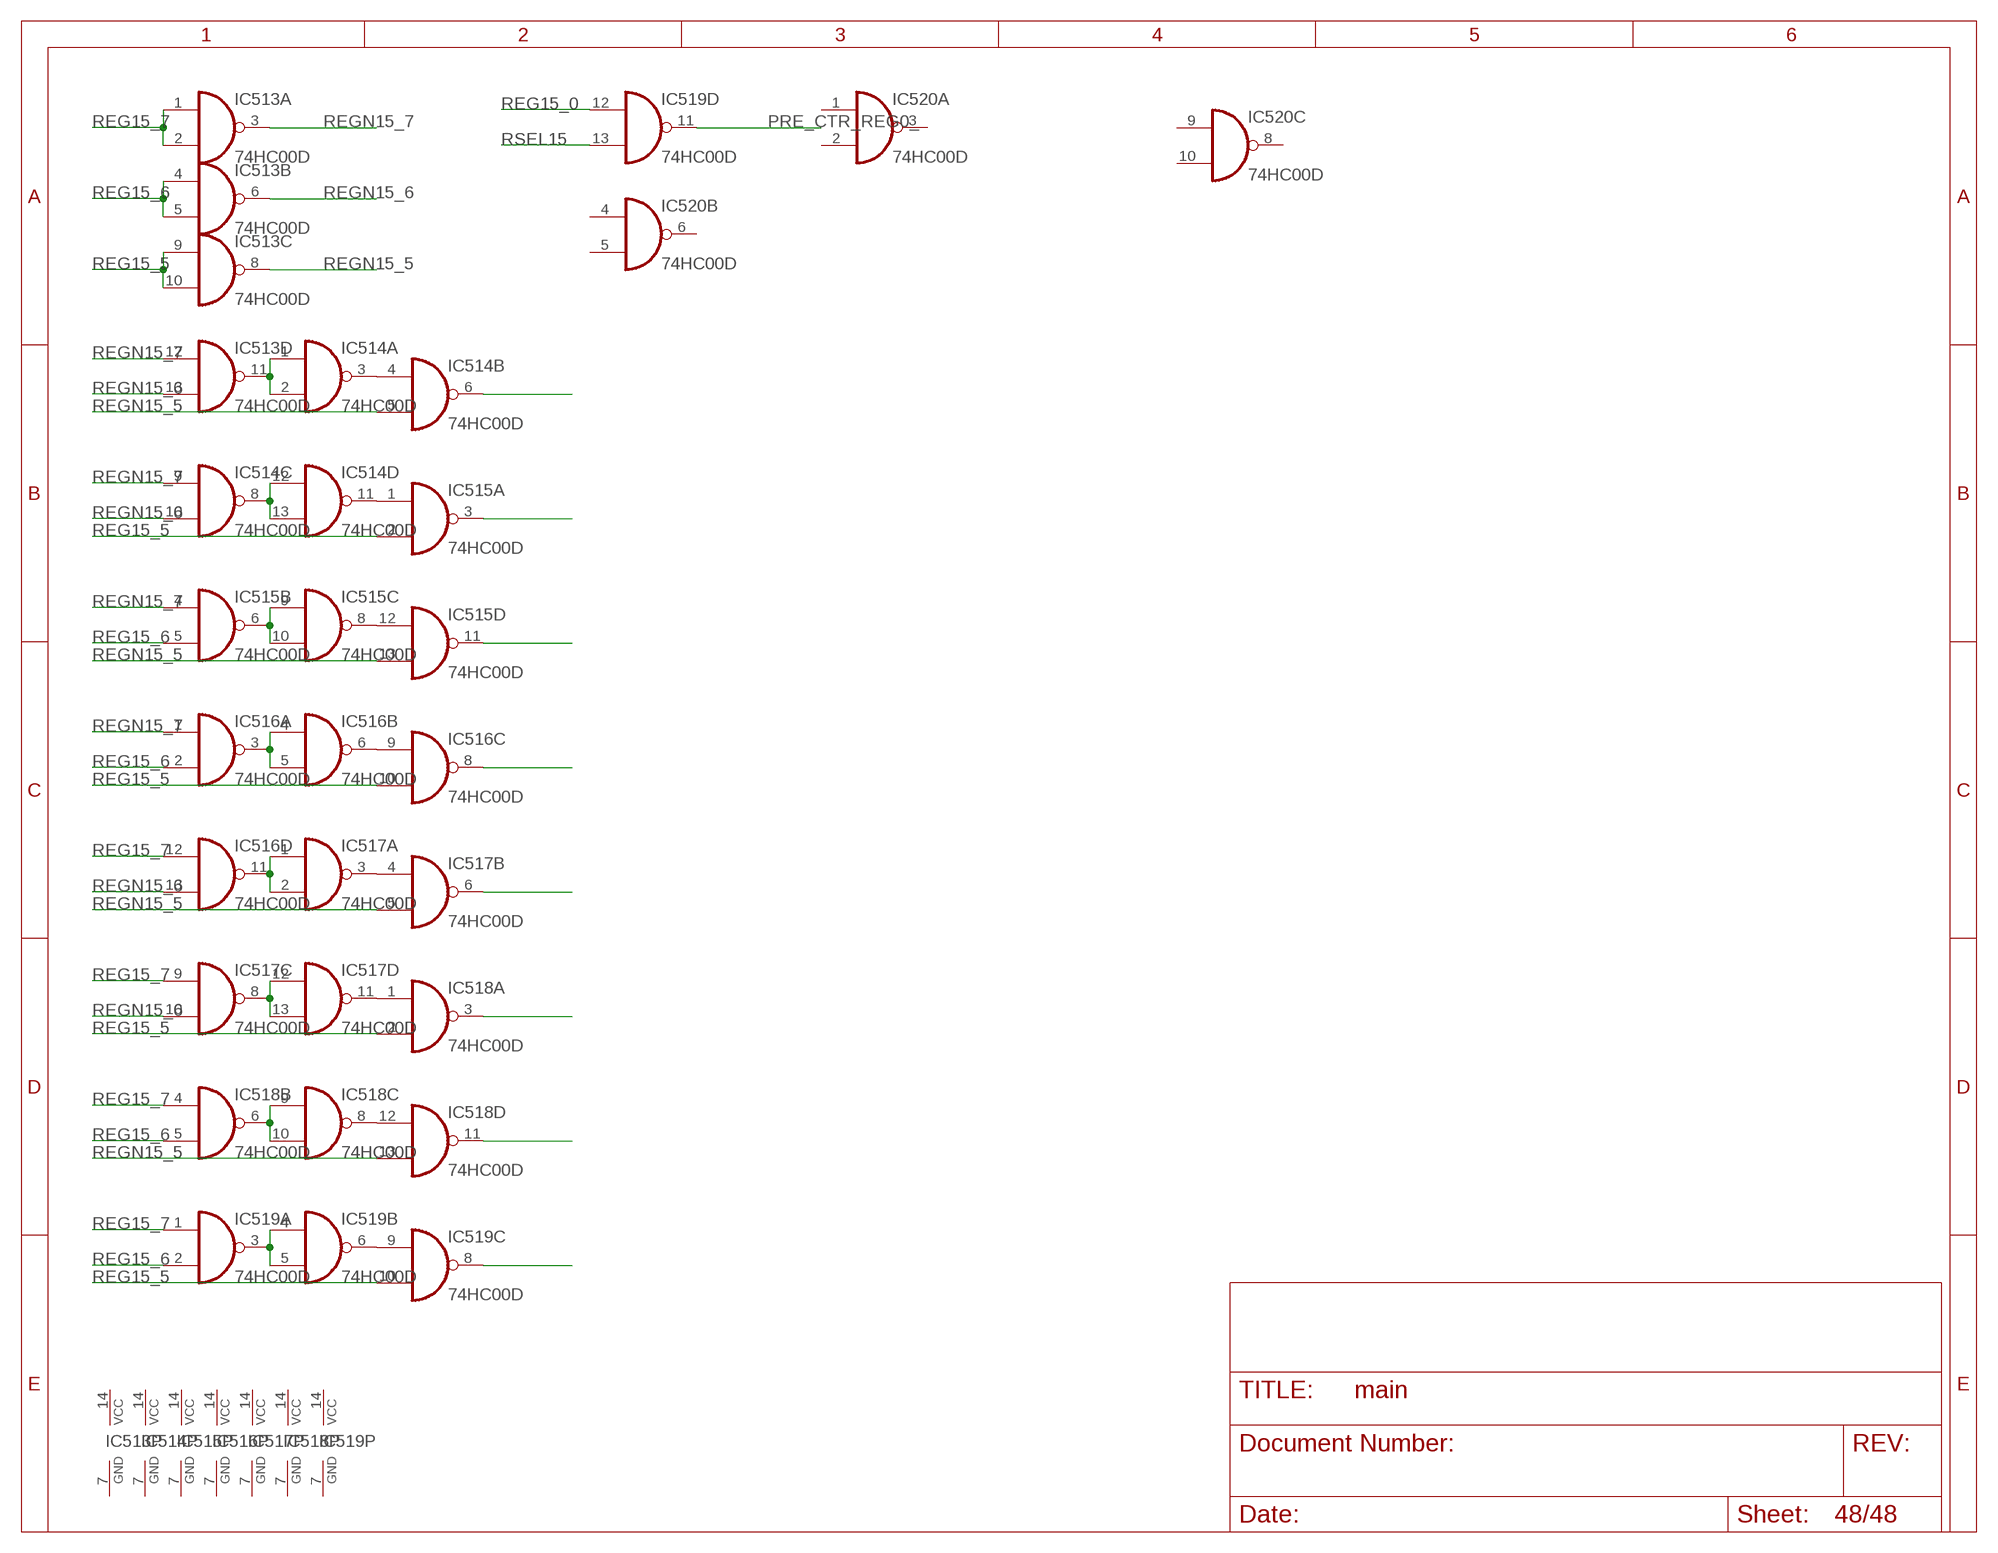
[diagram p46: schematic, sheet 48]

### Parts
IC513  74HC00D  [SO14]
IC514  74HC00D  [SO14]
IC515  74HC00D  [SO14]
IC516  74HC00D  [SO14]
IC517  74HC00D  [SO14]
IC518  74HC00D  [SO14]
IC519  74HC00D  [SO14]
IC520  74HC00D  [SO14]

### Nets
N$1107: IC514.3(A:O) IC514.4(B:I0)
N$1109: IC514.11(D:O) IC515.1(A:I0)
N$1111: IC515.8(C:O) IC515.12(D:I0)
N$1113: IC516.6(B:O) IC516.9(C:I0)
N$1114: IC517.3(A:O) IC517.4(B:I0)
N$1115: IC517.11(D:O) IC518.1(A:I0)
N$1116: IC518.8(C:O) IC518.12(D:I0)
N$1117: IC519.6(B:O) IC519.9(C:I0)
N$1118: IC513.11(D:O) IC514.1(A:I0) IC514.2(A:I1)
N$1119: IC514.8(C:O) IC514.12(D:I0) IC514.13(D:I1)
N$1120: IC515.6(B:O) IC515.9(C:I0) IC515.10(C:I1)
N$1121: IC516.3(A:O) IC516.4(B:I0) IC516.5(B:I1)
N$1122: IC516.11(D:O) IC517.1(A:I0) IC517.2(A:I1)
N$1123: IC517.8(C:O) IC517.12(D:I0) IC517.13(D:I1)
N$1124: IC518.6(B:O) IC518.9(C:I0) IC518.10(C:I1)
N$1125: IC519.3(A:O) IC519.4(B:I0) IC519.5(B:I1)
N$1220: IC514.6(B:O)
N$1221: IC515.3(A:O)
N$1222: IC515.11(D:O)
N$1223: IC516.8(C:O)
N$1224: IC517.6(B:O)
N$1225: IC518.3(A:O)
N$1226: IC518.11(D:O)
N$1227: IC519.8(C:O)
PRE_CTR_REG0_: IC519.11(D:O)
REG15_0: IC519.12(D:I0) ; also sheet 41,43
REG15_5: IC513.9(C:I0) IC513.10(C:I1) IC515.2(A:I1) IC516.10(C:I1) IC518.2(A:I1) IC519.10(C:I1) ; also sheet 40,42
REG15_6: IC513.4(B:I0) IC513.5(B:I1) IC515.5(B:I1) IC516.2(A:I1) IC518.5(B:I1) IC519.2(A:I1) ; also sheet 40,42
REG15_7: IC513.1(A:I0) IC513.2(A:I1) IC516.12(D:I0) IC517.9(C:I0) IC518.4(B:I0) IC519.1(A:I0) ; also sheet 40,42
REGN15_5: IC513.8(C:O) IC514.5(B:I1) IC515.13(D:I1) IC517.5(B:I1) IC518.13(D:I1)
REGN15_6: IC513.6(B:O) IC513.13(D:I1) IC514.10(C:I1) IC516.13(D:I1) IC517.10(C:I1)
REGN15_7: IC513.3(A:O) IC513.12(D:I0) IC514.9(C:I0) IC515.4(B:I0) IC516.1(A:I0)
RSEL15: IC519.13(D:I1) ; also sheet 46
Unconnected: IC520.1(A:I0) IC520.2(A:I1) IC520.3(A:O) IC520.4(B:I0) IC520.5(B:I1) IC520.6(B:O) IC520.8(C:O) IC520.9(C:I0) IC520.10(C:I1) IC520.11(D:O) IC520.12(D:I0) IC520.13(D:I1)

## Power pins joined to a net without a drawn wire
GND: IC266.7(P:GND) IC267.7(P:GND) IC268.7(P:GND) IC269.7(P:GND) IC270.7(P:GND) IC271.7(P:GND) IC272.7(P:GND) IC273.7(P:GND) IC275.7(P:GND) IC276.7(P:GND) IC277.7(P:GND) IC278.7(P:GND) IC279.7(P:GND) IC280.7(P:GND) IC281.7(P:GND) IC282.7(P:GND) IC283.7(P:GND) IC284.7(P:GND) IC285.7(P:GND) IC332.7(P:GND) IC475.7(P:GND) IC476.7(P:GND) IC477.7(P:GND) IC478.7(P:GND) IC483.7(P:GND) IC484.7(P:GND) IC485.7(P:GND) IC486.7(P:GND) IC513.7(P:GND) IC514.7(P:GND) IC515.7(P:GND) IC516.7(P:GND) IC517.7(P:GND) IC518.7(P:GND) IC519.7(P:GND) IC520.7(P:GND)
VCC: IC266.14(P:VCC) IC267.14(P:VCC) IC268.14(P:VCC) IC269.14(P:VCC) IC270.14(P:VCC) IC271.14(P:VCC) IC272.14(P:VCC) IC273.14(P:VCC) IC275.14(P:VCC) IC276.14(P:VCC) IC277.14(P:VCC) IC278.14(P:VCC) IC279.14(P:VCC) IC280.14(P:VCC) IC281.14(P:VCC) IC282.14(P:VCC) IC283.14(P:VCC) IC284.14(P:VCC) IC285.14(P:VCC) IC332.14(P:VCC) IC475.14(P:VCC) IC476.14(P:VCC) IC477.14(P:VCC) IC478.14(P:VCC) IC483.14(P:VCC) IC484.14(P:VCC) IC485.14(P:VCC) IC486.14(P:VCC) IC513.14(P:VCC) IC514.14(P:VCC) IC515.14(P:VCC) IC516.14(P:VCC) IC517.14(P:VCC) IC518.14(P:VCC) IC519.14(P:VCC) IC520.14(P:VCC)

## Library data of the parts
BENC0 BENC1-BENC10 IC1-IC233 IC250-IC292 IC301-IC381 IC383-IC399 IC447 IC448 IC472-IC474 IC487-IC502 IC513-IC520 = 74HC00:74*00: Quad 2-input NAND gate
IC234-IC249 IC293-IC300 IC382 IC400-IC446 IC449-IC471 IC475-IC486 IC503-IC512 = 74HC00:74*125: Quad bus BUFFER, 3-state